# EAGLE design Radio_RPIv15_868 (EAGLE 8.4.3)
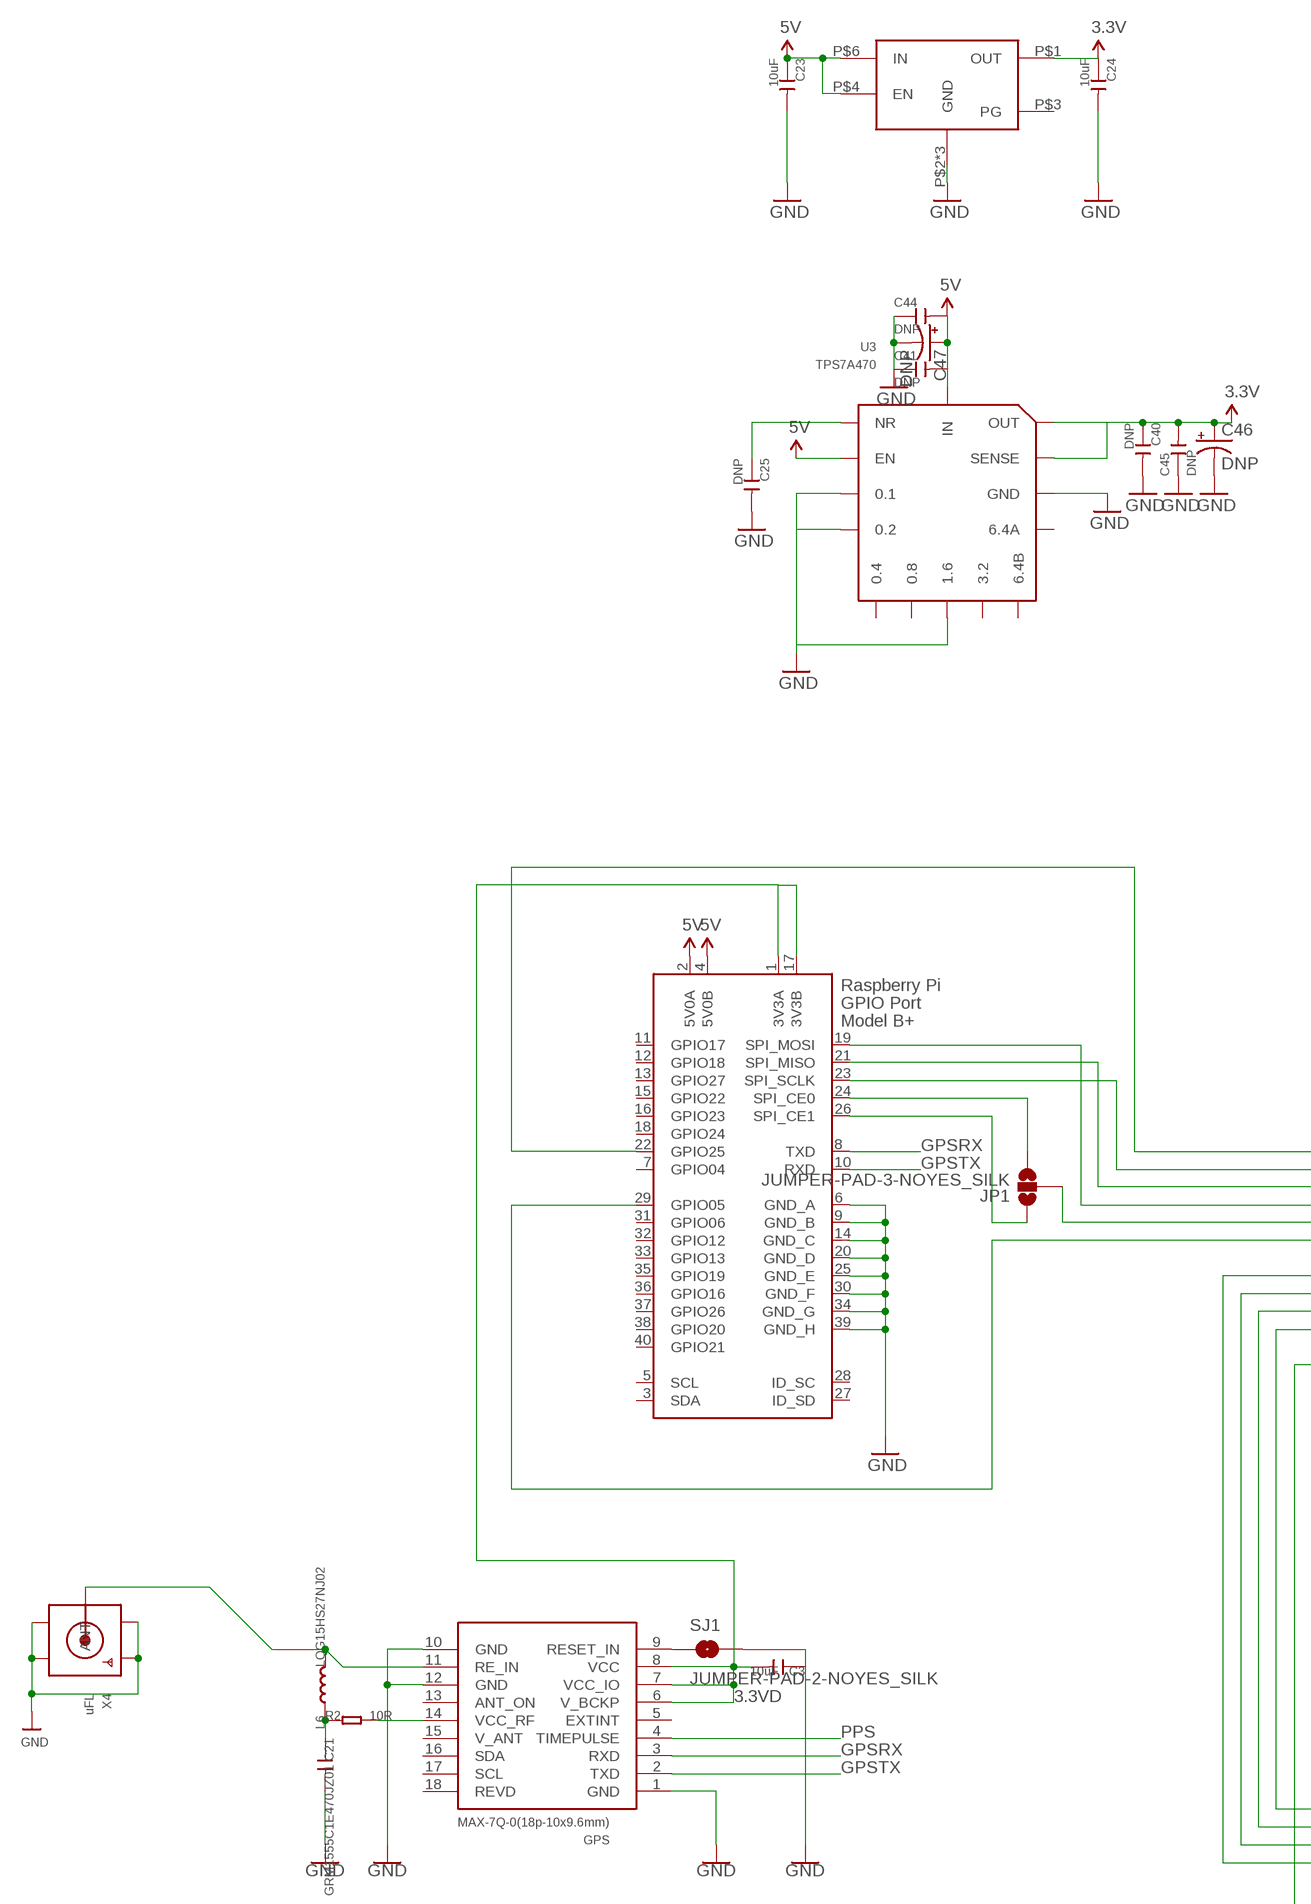
[diagram p0: schematic, sheet 1, part 1 of 3]
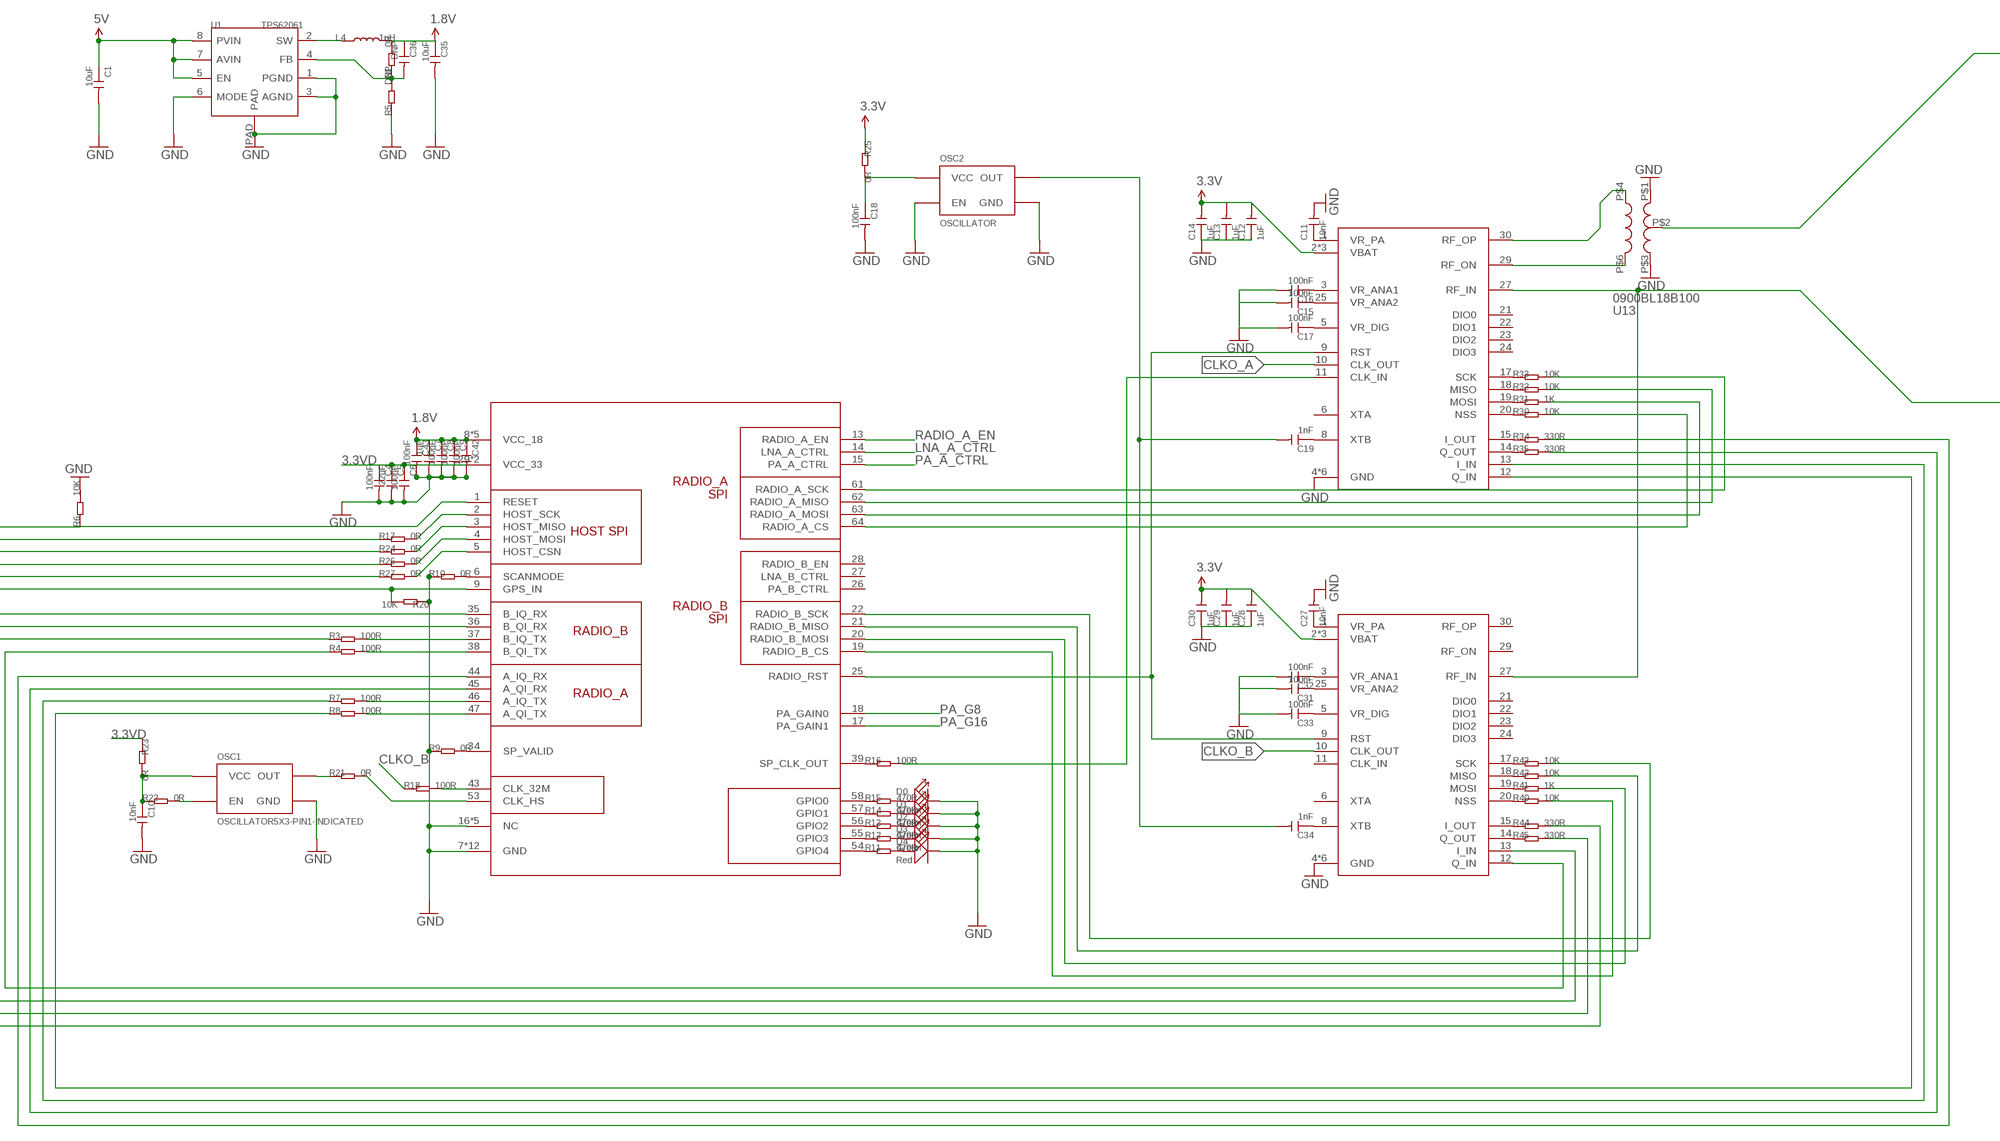
[diagram p1: schematic, sheet 1, part 2 of 3]
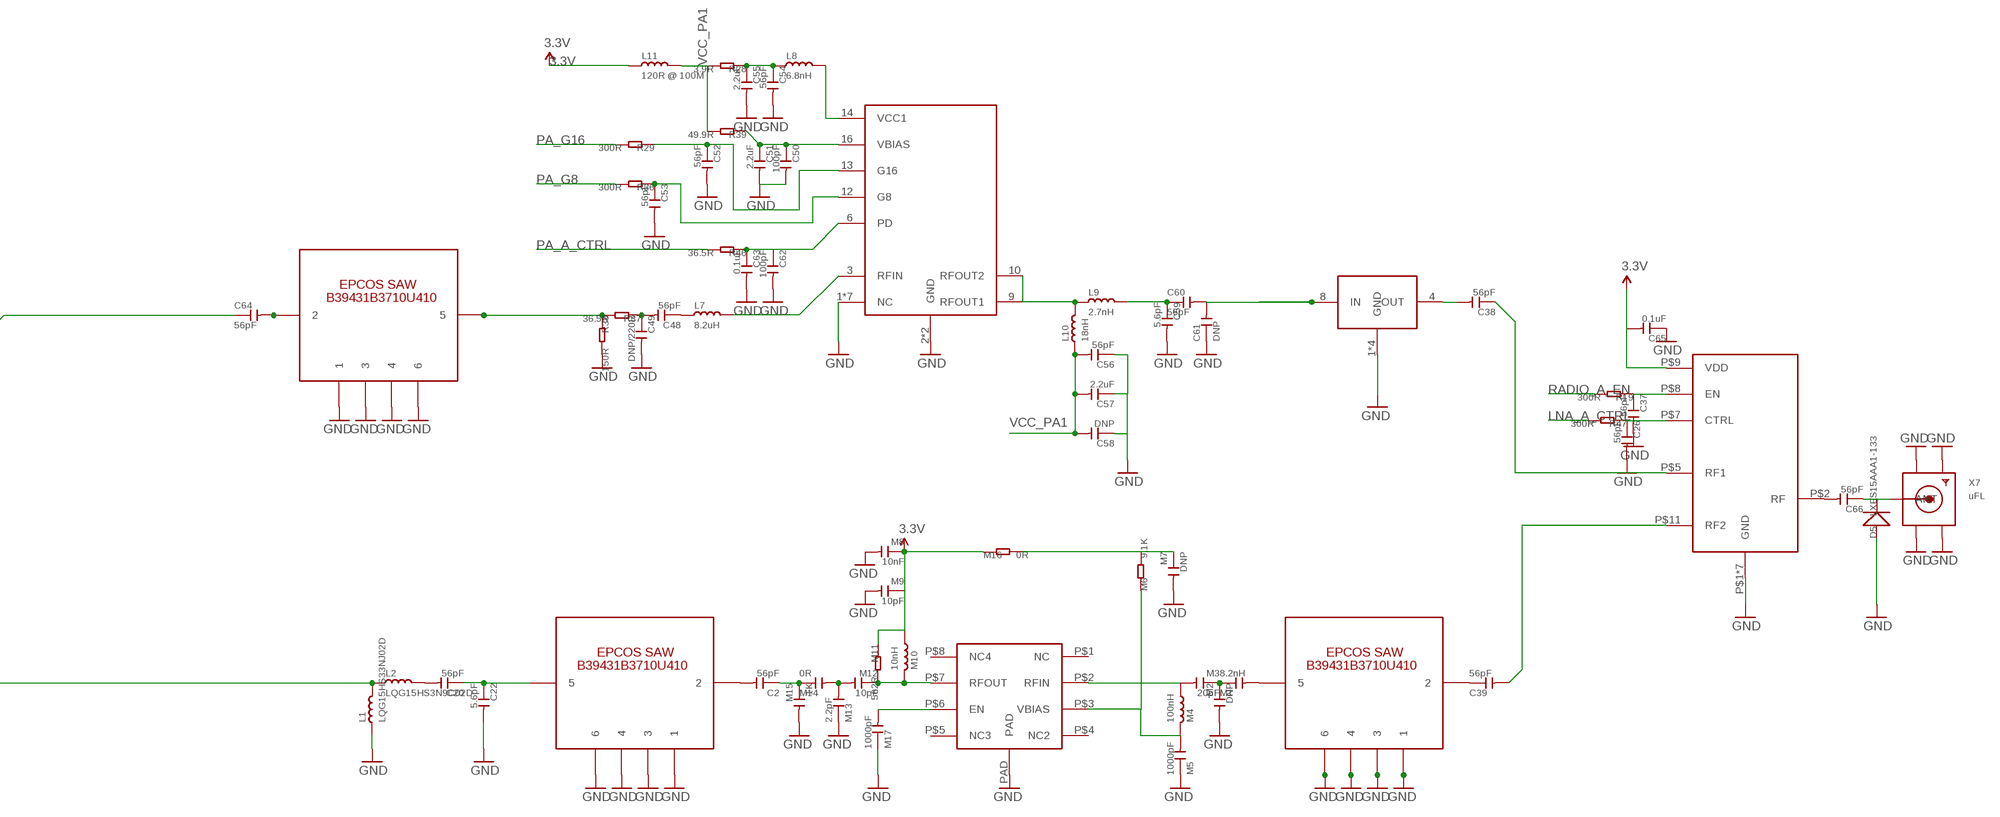
[diagram p2: schematic, sheet 1, part 3 of 3]

## Parts
C1  10uF  CAP-0603  [C0603@1]
C2  56pF  CAP-0402  [C0402@1]
C3  10uF  C-0603  [C0603]
C4  100nF  CAP-0402  [C0402@1]
C5  22uF  CAP-0402  [C0402@1]
C6  100nF  CAP-0402  [C0402@1]
C7  1uF  CAP-0402  [C0402@1]
C8  100nF  CAP-0402  [C0402@1]
C9  100nF  CAP-0402  [C0402@1]
C10  10nF  CAP-0402  [C0402@1]
C11  10nF  CAP-0402  [C0402@1]
C12  1uF  CAP-0402  [C0402@1]
C13  1uF  CAP-0402  [C0402@1]
C14  1uF  CAP-0402  [C0402@1]
C15  100nF  CAP-0402  [C0402@1]
C16  100nF  CAP-0402  [C0402@1]
C17  100nF  CAP-0402  [C0402@1]
C18  100nF  CAP-0402  [C0402@1]
C19  1nF  CAP-0402  [C0402@1]
C20  56pF  CAP-0402  [C0402@1]
C21  GRM1555C1E470JZ01  C-0402  [C0402]
C22  5.6pF  CAP-0402  [C0402@1]
C23  10uF  CAP-0603  [C0603@1]
C24  10uF  CAP-0603  [C0603@1]
C25  DNP  CAP-0402  [C0402@1]
C26  56pF  CAP-0402  [C0402@1]
C27  10nF  CAP-0402  [C0402@1]
C28  1uF  CAP-0402  [C0402@1]
C29  1uF  CAP-0402  [C0402@1]
C30  1uF  CAP-0402  [C0402@1]
C31  100nF  CAP-0402  [C0402@1]
C32  100nF  CAP-0402  [C0402@1]
C33  100nF  CAP-0402  [C0402@1]
C34  1nF  CAP-0402  [C0402@1]
C35  10uF  CAP-0603  [C0603@1]
C36  DNP  CAP-0402  [C0402@1]
C37  56pF  CAP-0402  [C0402@1]
C38  56pF  CAP-0402  [C0402@1]
C39  56pF  CAP-0402  [C0402@1]
C40  DNP  CAP-0402  [C0402@1]
C41  DNP  CAP-0402  [C0402@1]
C42  100nF  CAP-0402  [C0402@1]
C43  100nF  CAP-0402  [C0402@1]
C44  DNP  CAP-0805  [C0805@1]
C45  DNP  CAP-0805  [C0805@1]
C46  DNP  CAP_POL1206  [EIA3216]
C47  DNP  CAP_POL1206  [EIA3216]
C48  56pF  CAP-0402  [C0402@1]
C49  DNP/220R  CAP-0402  [C0402@1]
C50  100pF  CAP-0402  [C0402@1]
C51  2.2uF  CAP-0402  [C0402@1]
C52  56pF  CAP-0402  [C0402@1]
C53  56pF  CAP-0402  [C0402@1]
C54  56pF  CAP-0402  [C0402@1]
C55  2.2uF  CAP-0402  [C0402@1]
C56  56pF  CAP-0402  [C0402@1]
C57  2.2uF  CAP-0402  [C0402@1]
C58  DNP  CAP-0402  [C0402@1]
C59  5.6pF  CAP-0402  [C0402@1]
C60  56pF  CAP-0402  [C0402@1]
C61  DNP  CAP-0402  [C0402@1]
C62  100pF  CAP-0402  [C0402@1]
C63  0.1uF  CAP-0402  [C0402@1]
C64  56pF  CAP-0402  [C0402@1]
C65  0.1uF  CAP-0402  [C0402@1]
C66  56pF  CAP-0402  [C0402@1]
D0  Green  LED-0603  [LED-0603]
D1  Green  LED-0603  [LED-0603]
D2  Green  LED-0603  [LED-0603]
D3  Green  LED-0603  [LED-0603]
D4  Red  LED-0603  [LED-0603]
D5  LXES15AAA1-133  D  [C0402]
GPS  MAX-7Q-0(18p-10x9.6mm)  MODULE-GPS-SMD-MAX-7Q-0(18P-9.6X10MM)  [GPS18P-SMD-1.1-10X9.6MM]
JP1  JUMPER-PAD-3-NOYES_SILK  [PAD-JUMPER-3-NO_YES_SILK]
L1  LQG15HS33NJ02D  INDUCTOR/FERRITE-BEAD-0402  [L0402@1]
L2  LQG15HS3N9C02D  INDUCTOR/FERRITE-BEAD-0402  [L0402@1]
L4  1uH  L'1616BZ'  [1616BZ]
L6  LQG15HS27NJ02  L'0402'  [L0402]
L7  8.2uH  INDUCTOR/FERRITE-BEAD-0402  [L0402@1]
L8  6.8nH  INDUCTOR/FERRITE-BEAD-0402  [L0402@1]
L9  2.7nH  INDUCTOR/FERRITE-BEAD-0402  [L0402@1]
L10  18nH  INDUCTOR/FERRITE-BEAD-0402  [L0402@1]
L11  120R @ 100M  INDUCTOR/FERRITE-BEAD-0402  [L0402@1]
M1  8.2nH  CAP-0402  [C0402@1]
M2  DNP  CAP-0402  [C0402@1]
M3  20pF  CAP-0402  [C0402@1]
M4  100nH  INDUCTOR/FERRITE-BEAD-0402  [L0402@1]
M5  1000pF  CAP-0402  [C0402@1]
M6  9.1K  R-0402  [R0402]
M7  DNP  CAP-0402  [C0402@1]
M8  10nF  CAP-0402  [C0402@1]
M9  10pF  CAP-0402  [C0402@1]
M10  10nH  INDUCTOR/FERRITE-BEAD-0402  [L0402@1]
M11  562R  R-0402  [R0402]
M12  10pF  CAP-0402  [C0402@1]
M13  2.2pF  CAP-0402  [C0402@1]
M14  0R  CAP-0402  [C0402@1]
M15  1K  CAP-0402  [C0402@1]
M16  0R  R-0402  [R0402]
M17  1000pF  CAP-0402  [C0402@1]
OSC1  OSCILLATOR5X3-PIN1-INDICATED  [CRYSTAL-OSC-SMD-5X3]
OSC2  OSCILLATOR  [CRYSTAL-OSC-SMD-3.2X2.5]
R1  0R  R-0402  [R0402]
R2  10R  R-0402  [R0402]
R3  100R  R-0402  [R0402]
R4  100R  R-0402  [R0402]
R5  DNP  R-0402  [R0402]
R6  10K  R-0402  [R0402]
R7  100R  R-0402  [R0402]
R8  100R  R-0402  [R0402]
R9  0R  R-0402  [R0402]
R10  0R  R-0402  [R0402]
R11  470R  R-0402  [R0402]
R12  470R  R-0402  [R0402]
R13  470R  R-0402  [R0402]
R14  470R  R-0402  [R0402]
R15  470R  R-0402  [R0402]
R16  100R  R-0402  [R0402]
R17  0R  R-0402  [R0402]
R18  100R  R-0402  [R0402]
R19  300R  R-0402  [R0402]
R20  10K  R-0402  [R0402]
R21  0R  R-0402  [R0402]
R22  0R  R-0402  [R0402]
R23  0R  R-0402  [R0402]
R24  0R  R-0402  [R0402]
R25  0R  R-0402  [R0402]
R26  0R  R-0402  [R0402]
R27  0R  R-0402  [R0402]
R28  3.9R  R-0402  [R0402]
R29  300R  R-0402  [R0402]
R30  10K  R-0402  [R0402]
R31  1K  R-0402  [R0402]
R32  10K  R-0402  [R0402]
R33  10K  R-0402  [R0402]
R34  330R  R-0402  [R0402]
R35  330R  R-0402  [R0402]
R36  300R  R-0402  [R0402]
R37  36.5R  R-0402  [R0402]
R38  150R  R-0402  [R0402]
R39  49.9R  R-0402  [R0402]
R40  10K  R-0402  [R0402]
R41  1K  R-0402  [R0402]
R42  10K  R-0402  [R0402]
R43  10K  R-0402  [R0402]
R44  330R  R-0402  [R0402]
R45  330R  R-0402  [R0402]
R46  36.5R  R-0402  [R0402]
R47  300R  R-0402  [R0402]
SJ1  JUMPER-PAD-2-NOYES_SILK  [PAD-JUMPER-2-NO_YES_SILK]
U1  TPS62061  PMIC-ETA3410D2I-T(DFN8-2X2)WSON  [WSON]
U3  TPS7A470  [S-PVQFN-N20]
U6  RFPA0133  [QFN16-3X3MM]
U13  0900BL18B100  BALUN_1206  [BALUN_1206]
U$1  SX1301  [QFN64G-0.5-9X9MM]
U$2  SX1255  [QFN32G-0.5-5X5MM]
U$3  SX1255  [QFN32G-0.5-5X5MM]
U$4  B39921B3728U410  EPCOS_SAW_FILTER  [EPCOS_SAW_FILTER]
U$5  LP5912  [WSON6]
U$6  0915LP15B026  [0915LP15B026]
U$7  RFSW1012  [QFN12-2X2MM]
U$8  B39921B3728U410  EPCOS_SAW_FILTER  [EPCOS_SAW_FILTER]
U$9  EPCOS_SAW_FILTER  [EPCOS_SAW_FILTER]
U$10  SKY67150_396LF  [8DFN]
X1  RASPI_BOARD_B+#_H  [RASPI_BOARD_B+HAT]
X4  uFL  SMACONNECTOR_EDGE_UFL  [SMA_EDGELAUNCH_UFL]
X7  uFL  SMACONNECTOR_EDGE_UFL  [SMA_EDGELAUNCH_UFL]

## Nets
1.8V: C7.1 C8.1 C9.1 C35.1 C36.1 C42.1 C43.1 L4.2 R1.2 U$1.8(VCC_18) U$1.12(VCC_18) U$1.23(VCC_18) U$1.42(VCC_18) U$1.60(VCC_18)
3.3V: C12.2 C13.2 C14.2 C24.1 C28.2 C29.2 C30.2 C40.1 C45.2 C46.A(+) C65.2 L11.1 M8.1 M9.1 M10.2 M11.1 M16.1 R25.1 U3.1(OUT) U3.3(SENSE) U3.20(OUT) U$2.2(VBAT) U$2.16(VBAT) U$2.32(VBAT) U$3.2(VBAT) U$3.16(VBAT) U$3.32(VBAT) U$5.P$1(OUT) U$7.P$9(VDD)
3.3VD: C3.2 C4.1 C5.1 C6.1 GPS.6(V_BCKP) GPS.7(VCC_IO) GPS.8(VCC) R23.1 U$1.29(VCC_33) U$1.52(VCC_33) X1.1(3V3A) X1.17(3V3B)
5V: C1.1 C23.1 C41.2 C44.2 C47.A(+) U1.5(EN) U1.7(AVIN) U1.8(PVIN) U3.13(EN) U3.15(IN) U3.16(IN) U$5.P$4(EN) U$5.P$6(IN) X1.2(5V0A) X1.4(5V0B)
CLKO_A: U$2.10(CLK_OUT)
CLKO_B: R18.1 U$3.10(CLK_OUT)
CS: R27.2 U$1.5(HOST_CSN)
FEWF: D4.+ R11.2
GND: C1.2 C3.1 C4.2 C5.2 C6.2 C7.2 C8.2 C9.2 C10.2 C11.2 C12.1 C13.1 C14.1 C15.2 C16.2 C17.2 C18.2 C21.2 C22.2 C23.2 C24.2 C25.2 C26.2 C27.2 C28.1 C29.1 C30.1 C31.2 C32.2 C33.2 C35.2 C37.2 C40.2 C41.1 C42.2 C43.2 C44.1 C45.1 C46.C(-) C47.C(-) C49.2 C50.2 C51.2 C52.2 C53.2 C54.2 C55.2 C56.1 C57.1 C58.1 C59.2 C61.1 C62.2 C63.2 C65.1 D0.- D1.- D2.- D3.- D4.- D5.1(+) GPS.1(GND) GPS.10(GND) GPS.12(GND) L1.1 M2.2 M5.1 M7.2 M8.2 M9.2 M13.1 M15.2 M17.1 OSC1.2(GND) OSC2.P$1(EN) OSC2.P$2(GND) R5.1 R6.2 R9.1 R10.1 R20.1 R38.2 SJ1.2 U1.1(PGND) U1.3(AGND) U1.6(MODE) U1.PAD U3.2(GND) U3.7(GND) U3.8(1.6) U3.11(0.2) U3.12(0.1) U3.17(GND) U3.18(GND) U3.19(GND) U3.EXP(GND) U6.1(NC) U6.2(GND) U6.4(NC) U6.5(NC) U6.7(NC) U6.8(NC) U6.11(NC) U6.15(NC) U6.EXT(GND) U13.P$1(GND_1) U13.P$3(GND_2) U$1.7(GND) U$1.10(GND) U$1.11(GND) U$1.16(NC) U$1.24(GND) U$1.30(GND) U$1.31(GND) U$1.32(NC) U$1.33(NC) U$1.40(GND) U$1.41(GND) U$1.48(NC) U$1.49(NC) U$1.50(GND) U$1.51(GND) U$1.59(GND) U$1.65(GND) U$2.4(GND) U$2.7(GND) U$2.26(GND) U$2.28(GND) U$2.31(GND) U$2.33(GND) U$3.4(GND) U$3.7(GND) U$3.26(GND) U$3.28(GND) U$3.31(GND) U$3.33(GND) U$4.P$1 U$4.P$3 U$4.P$4 U$4.P$6 U$5.P$2(GND) U$5.P$5(GND) U$5.PAD(GND) U$6.1(GND) U$6.3(GND) U$6.5(GND) U$6.7(GND) U$7.P$1(GND) U$7.P$3(GND) U$7.P$4(GND) U$7.P$6(GND) U$7.P$10(GND) U$7.P$12(GND) U$7.PAD(GND) U$8.P$1 U$8.P$3 U$8.P$4 U$8.P$6 U$9.P$1 U$9.P$3 U$9.P$4 U$9.P$6 U$10.PAD X1.6(GND_A) X1.9(GND_B) X1.14(GND_C) X1.20(GND_D) X1.25(GND_E) X1.30(GND_F) X1.34(GND_G) X1.39(GND_H) X4.GND@1(GND1) X4.GND@2(GND2) X4.GND@3(GND3) X4.GND@4(GND4) X7.GND@1(GND1) X7.GND@2(GND2) X7.GND@3(GND3) X7.GND@4(GND4)
GPSRX: GPS.3(RXD) X1.8(TXD)
GPSTX: GPS.2(TXD) X1.10(RXD)
LNA_A_CTRL: R47.2 U$1.14(LNA_A_CTRL)
MISO: R24.1 X1.21(SPI_MISO)
MOSI: R26.1 X1.19(SPI_MOSI)
N$1: R30.1 U$2.20(NSS)
N$2: R45.2 U$1.36(B_QI_RX)
N$3: R3.2 U$1.37(B_IQ_TX)
N$4: R4.2 U$1.38(B_QI_TX)
N$5: R34.2 U$1.44(A_IQ_RX)
N$6: R7.2 U$1.46(A_IQ_TX)
N$7: R8.2 U$1.47(A_QI_TX)
N$8: R35.2 U$1.45(A_QI_RX)
N$9: R9.2 U$1.34(SP_VALID)
N$10: R10.2 U$1.6(SCANMODE)
N$11: C20.2 L2.2
N$12: R11.1 U$1.54(GPIO4)
N$13: R12.1 U$1.55(GPIO3)
N$14: R13.1 U$1.56(GPIO2)
N$15: R14.1 U$1.57(GPIO1)
N$16: R15.1 U$1.58(GPIO0)
N$17: C2.1 M14.1 M15.1
N$18: D3.+ R12.2
N$19: D1.+ R14.2
N$20: D0.+ R15.2
N$21: D2.+ R13.2
N$22: R16.1 U$1.39(SP_CLK_OUT)
N$23: C38.2 U$6.4(OUT)
N$24: C64.1 U13.P$2(UNBALANCE)
N$25: L4.1 U1.2(SW)
N$26: C36.2 R1.1 R5.2 U1.4(FB)
N$27: C21.1 L6.1 R2.1
N$28: JP1.3 X1.24(SPI_CE0)
N$29: C19.1 U$2.8(XTB)
N$30: R21.2 U$1.53(CLK_HS)
N$31: OSC1.3(OUT) R21.1
N$32: OSC1.1(EN) R22.2
N$33: C10.1 OSC1.4(VCC) R22.1 R23.2
N$34: GPS.14(VCC_RF) R2.2
N$35: C11.1 U$2.1(VR_PA)
N$36: C18.1 OSC2.P$4(VCC) R25.2
N$37: C19.2 C34.2 OSC2.P$3(OUT)
N$38: C15.1 U$2.25(VR_ANA2)
N$39: C16.1 U$2.3(VR_ANA1)
N$40: C17.1 U$2.5(VR_DIG)
N$41: GPS.11(RE_IN) L6.2 X4.P(ANT)
N$42: C39.1 U$9.P$2
N$43: R17.2 U$1.2(HOST_SCK)
N$44: C20.1 C22.1 U$4.P$5
N$45: R18.2 U$1.43(CLK_32M)
N$46: C2.2 U$4.P$2
N$47: GPS.9(RESET_IN) SJ1.1
N$48: R24.2 U$1.3(HOST_MISO)
N$49: L1.2 L2.1 U$2.27(RF_IN) U$3.27(RF_IN)
N$50: R26.2 U$1.4(HOST_MOSI)
N$51: JP1.2 R27.1
N$52: C25.1 U3.14(NR)
N$53: U13.P$4(BALANCE_1) U$2.30(RF_OP)
N$54: U13.P$6(BALANCE_2) U$2.29(RF_ON)
N$55: L7.2 U6.3(RFIN)
N$56: R34.1 U$2.15(I_OUT)
N$57: R35.1 U$2.14(Q_OUT)
N$58: C27.1 U$3.1(VR_PA)
N$59: C31.1 U$3.25(VR_ANA2)
N$60: C32.1 U$3.3(VR_ANA1)
N$61: C33.1 U$3.5(VR_DIG)
N$62: C34.1 U$3.8(XTB)
N$63: C48.1 L7.1
N$64: C64.2 U$8.P$2
N$65: C52.1 R29.1 U6.13(G16)
N$66: C53.1 R36.1 U6.12(G8)
N$67: L8.2 U6.14(VCC1)
N$68: C54.1 C55.1 L8.1 R28.1
N$69: L9.1 L10.2 U6.9(RFOUT1) U6.10(RFOUT2)
N$70: C59.1 C60.1 L9.2
N$71: C60.2 C61.2 U$6.8(IN)
N$72: C48.2 C49.1 R37.1
N$73: C62.1 C63.1 R46.1 U6.6(PD)
N$74: C38.1 U$7.P$5(RF1)
N$75: C66.2 U$7.P$2(RF)
N$76: R37.2 R38.1 U$8.P$5
N$77: C26.1 R47.1 U$7.P$7(CTRL)
N$78: R44.1 U$3.15(I_OUT)
N$79: R45.1 U$3.14(Q_OUT)
N$80: R33.2 U$1.61(RADIO_A_SCK)
N$81: R32.2 U$1.62(RADIO_A_MISO)
N$82: R31.2 U$1.63(RADIO_A_MOSI)
N$83: R30.2 U$1.64(RADIO_A_CS)
N$84: R43.2 U$1.22(RADIO_B_SCK)
N$85: R42.2 U$1.21(RADIO_B_MISO)
N$86: R41.2 U$1.20(RADIO_B_MOSI)
N$87: R40.2 U$1.19(RADIO_B_CS)
N$88: U$1.25(RADIO_RST) U$2.9(RST) U$3.9(RST)
N$89: R16.2 U$2.11(CLK_IN)
N$90: R44.2 U$1.35(B_IQ_RX)
N$91: R7.1 U$2.13(I_IN)
N$92: R3.1 U$3.13(I_IN)
N$93: R4.1 U$3.12(Q_IN)
N$94: R8.1 U$2.12(Q_IN)
N$95: JP1.1 X1.26(SPI_CE1)
N$96: C66.1 D5.2(-) X7.P(ANT)
N$97: C39.2 U$7.P$11(RF2)
N$98: M1.2 U$9.P$5
N$99: M1.1 M2.1 M3.1
N$100: R31.1 U$2.19(MOSI)
N$101: R32.1 U$2.18(MISO)
N$102: R33.1 U$2.17(SCK)
N$103: R40.1 U$3.20(NSS)
N$104: R41.1 U$3.19(MOSI)
N$105: R42.1 U$3.18(MISO)
N$106: R43.1 U$3.17(SCK)
N$107: M6.2 M7.1 M16.2
N$108: M10.1 M11.2 M12.1 U$10.P$7(RFOUT)
N$109: M12.2 M13.2 M14.2
N$110: C37.1 R19.1 U$7.P$8(EN)
N$111: M17.2 U$10.P$6(EN)
N$112: M3.2 M4.2 U$10.P$2(RFIN)
N$113: M4.1 M5.2 M6.1 U$10.P$3(VBIAS)
PA_A_CTRL: R46.2 U$1.15(PA_A_CTRL)
PA_G8: R36.2 U$1.18(PA_GAIN0)
PA_G16: R29.2 U$1.17(PA_GAIN1)
PPS: GPS.4(TIMEPULSE) R20.2 U$1.9(GPS_IN) X1.29(GPIO05)
RADIO_A_EN: R19.2 U$1.13(RADIO_A_EN)
RST: R6.1 U$1.1(RESET) X1.22(GPIO25)
SCK: R17.1 X1.23(SPI_SCLK)
VBIAS: C50.1 C51.1 R39.1 U6.16(VBIAS)
VCC_PA1: C56.2 C57.2 C58.2 L10.1 L11.2 R28.2 R39.2
Unconnected: GPS.5(EXTINT) GPS.13(ANT_ON) GPS.15(V_ANT) GPS.16(SDA) GPS.17(SCL) GPS.18(REVD) U3.4(6.4A) U3.5(6.4B) U3.6(3.2) U3.9(0.8) U3.10(0.4) U$1.26(PA_B_CTRL) U$1.27(LNA_B_CTRL) U$1.28(RADIO_B_EN) U$2.6(XTA) U$2.21(DIO0) U$2.22(DIO1) U$2.23(DIO2) U$2.24(DIO3) U$3.6(XTA) U$3.11(CLK_IN) U$3.21(DIO0) U$3.22(DIO1) U$3.23(DIO2) U$3.24(DIO3) U$3.29(RF_ON) U$3.30(RF_OP) U$5.P$3(PG) U$10.P$1(NC) U$10.P$4(NC2) U$10.P$5(NC3) U$10.P$8(NC4) X1.3(SDA) X1.5(SCL) X1.7(GPIO04) X1.11(GPIO17) X1.12(GPIO18) X1.13(GPIO27) X1.15(GPIO22) X1.16(GPIO23) X1.18(GPIO24) X1.27(ID_SD) X1.28(ID_SC) X1.31(GPIO06) X1.32(GPIO12) X1.33(GPIO13) X1.35(GPIO19) X1.36(GPIO16) X1.37(GPIO26) X1.38(GPIO20) X1.40(GPIO21)

## Library data of the parts
C1 C2 C4-C20 C22-C45 C48-C66 M1-M3 M5 M7-M9 M12-M15 M17 = Discrete:CAP: Ceramic Capacitors
C3 C21 = Discrete:C*: Ceramic Capacitors
C46 C47 = SparkFun-Capacitors:CAP_POL: Capacitor Polarized These are standard SMD and PTH capacitors. Normally 10uF, 47uF, and 100uF in electrolytic and tantalum varieties. Always verify the external diameter of the through hole cap, it varies with capacity, voltage, and manufacturer. The EIA devices should be standard.
D0 D1-D4 = Discrete:LED
D5 = Discrete:D*
GPS = Seeed-OPL-Moudle:MODULE-GPS-SMD-MAX-7Q-0(18P-9.6X10MM): 317050009; MPN: MAX-7Q-0
JP1 = SparkFun-Passives:JUMPER-PAD-3-NO
L1 L2 L7-L11 M4 M10 = Discrete:INDUCTOR/FERRITE-BEAD
L4 L6 = Discrete:L*
M6 M11 M16 R1-R47 = Discrete:R*
OSC1 OSC2 = SparkFun-FreqCtrl:OSCILLATOR: Generic 5x3 and 7x5 oscillators
SJ1 = SparkFun-Passives:JUMPER-PAD-2-NO
U1 = Seeed-OPL-ic:PMIC-ETA3410D2I-T(DFN8-2X2): 310030161
U3 = regulator-jqi:TPS7A470: Ultra-low noise LDO regulator, variable programmable output, 36V
U6 = SparkFun-IC-Power:RFPA0133
U13 = SparkFun-RF:BALUN_1206
U$1 = Seeed-OPL-ic:SX1301
U$2 U$3 = Seeed-OPL-ic:SX1255
U$4 U$8 U$9 = Ava:EPCOS_SAW_FILTER
U$5 = IC:LP5912
U$6 = SparkFun-RF:0915LP15B026
U$7 = SparkFun-IC-Power:RFSW1012
U$10 = SparkFun-RF:SKY67150_396LF
X1 = raspberrypi_bastelstube_v13:RASPI_BOARD_B+#: Raspberry Pi GPIO connector with markings for the outer dimensions of the Raspberry Pi board model B+ with different sets of drill holes or mounting pads All pins connected
X4 X7 = microbuilder:SMACONNECTOR: SMA Connector 90° DIP SMA Connector, 50 Ohm (4UConnector: 07259)

## Net classes
2 VIN: width 0.61 mm, drill 0.61 mm, clearance 0.305 mm

## Board
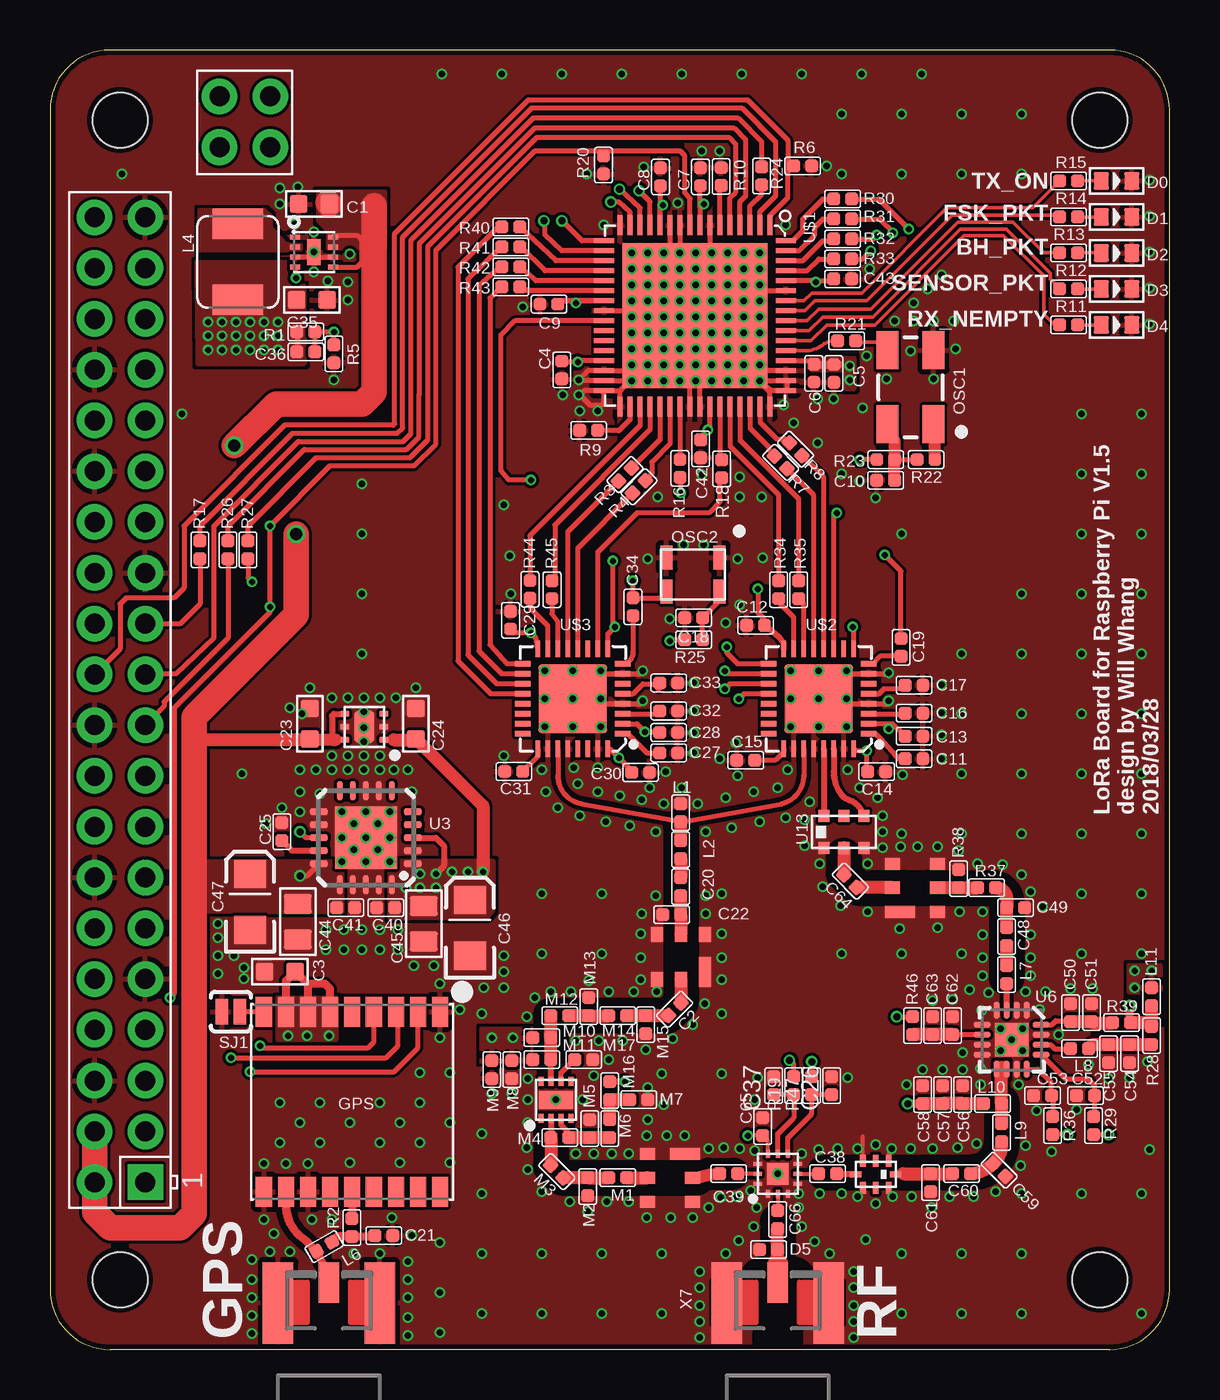
[diagram p3: board, top side]
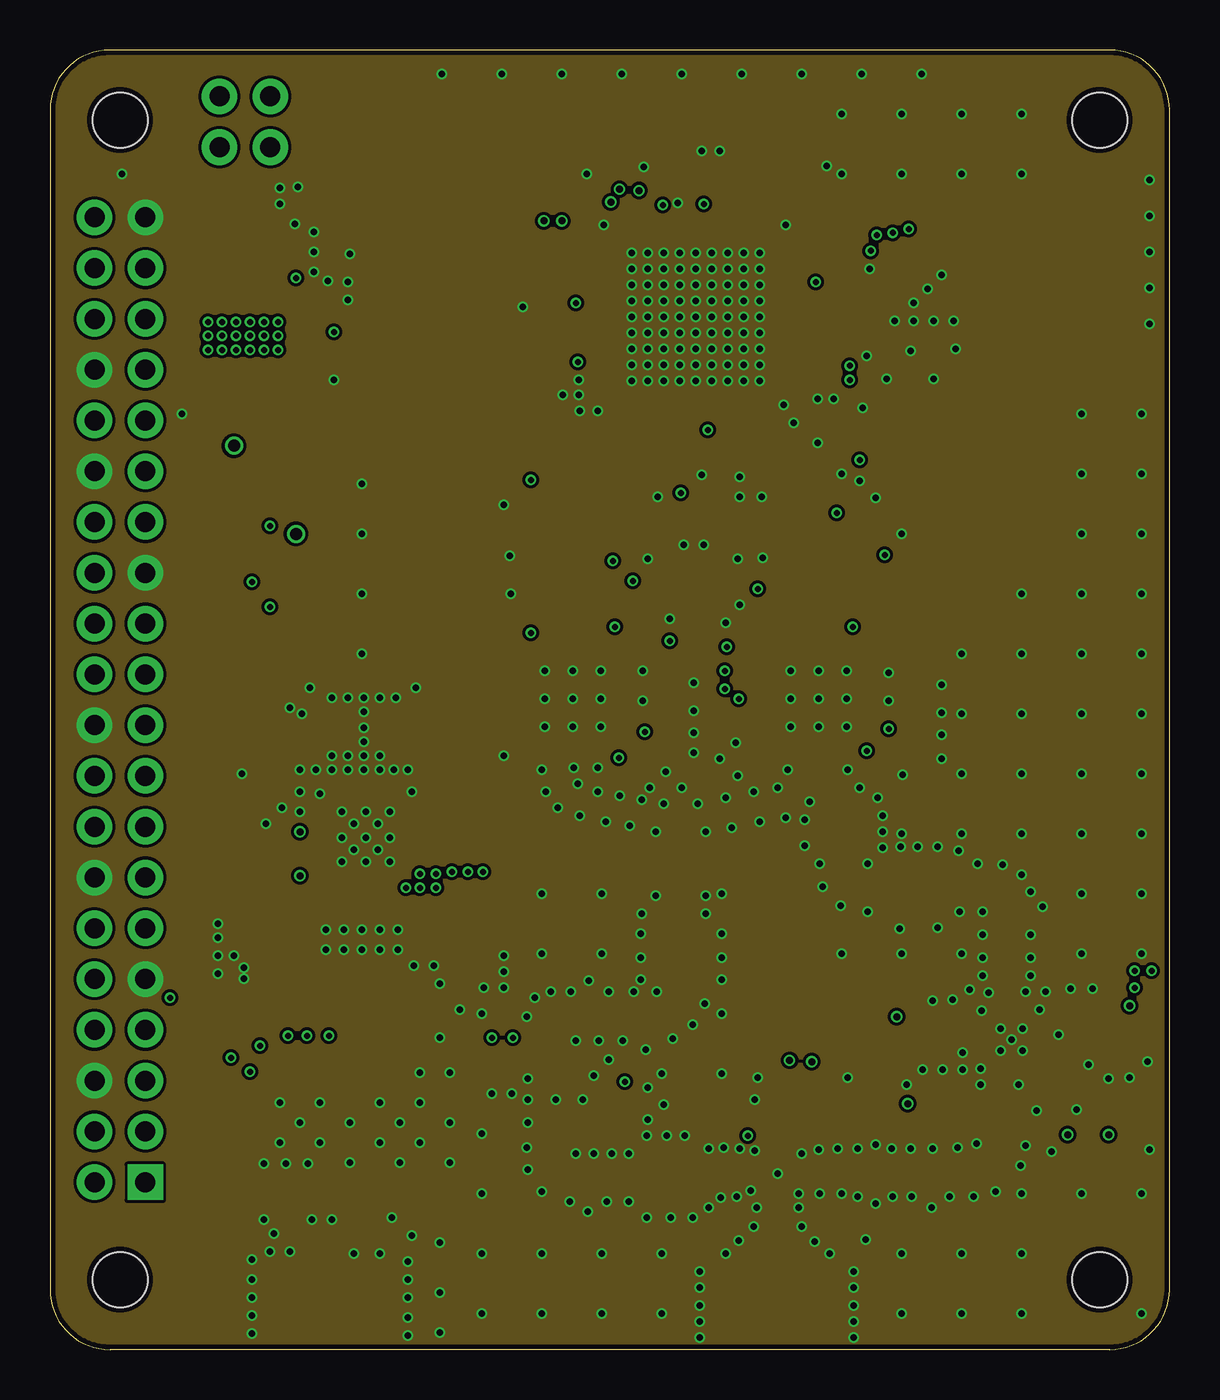
[diagram p4: board, inner layer $GND]
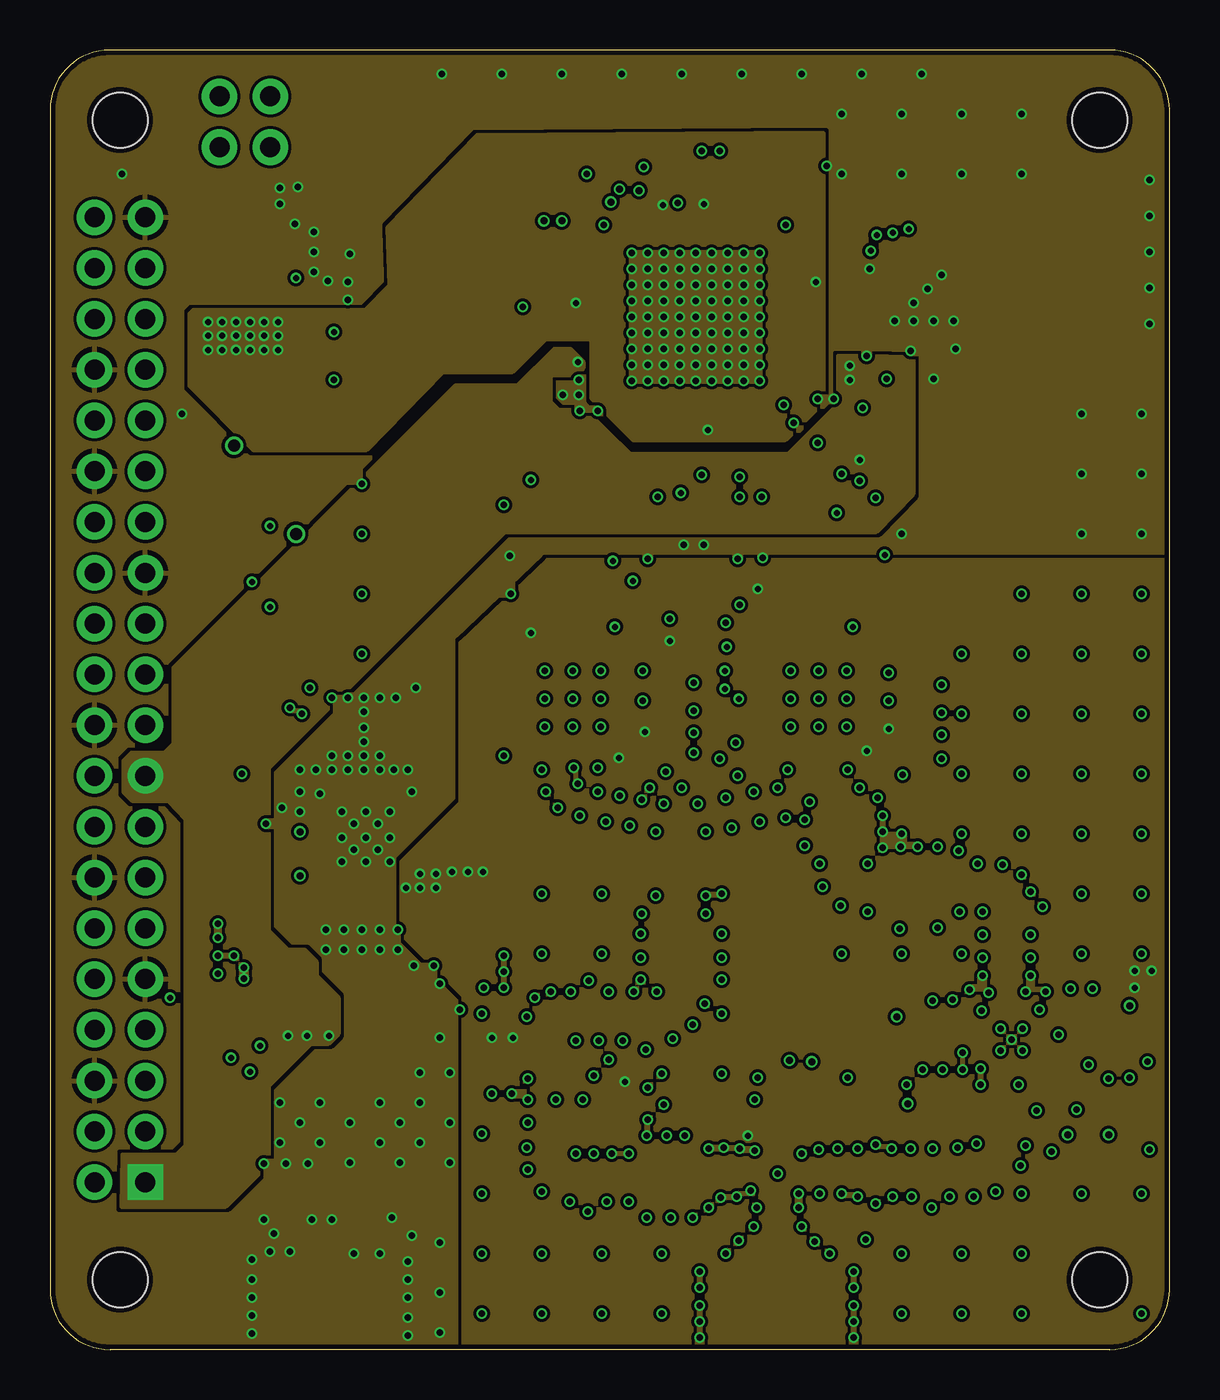
[diagram p5: board, inner layer $VCC]
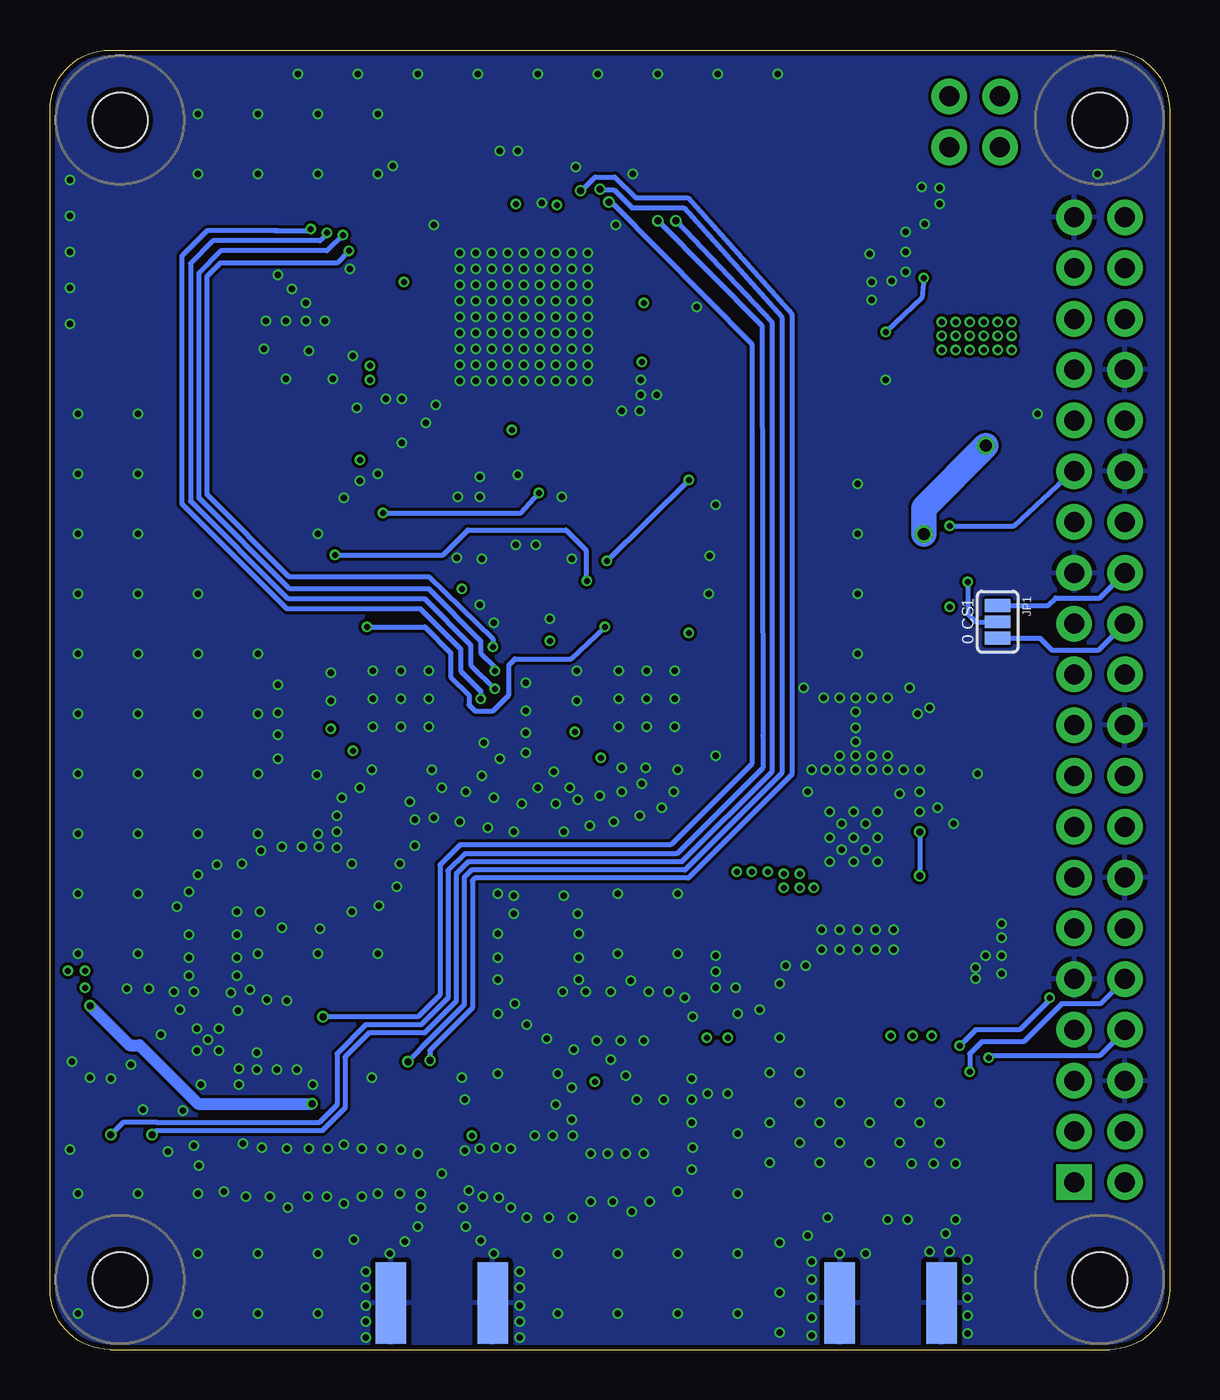
[diagram p6: board, bottom side, seen from below]

Size 56 x 65 mm. Coordinates in mm from the lower left corner, seen from the top.
Copper layers (1*2*15*16): Top 0.035mm / dielectric 0.2mm / $GND 0.0175mm / dielectric 0.3mm / $VCC 0.0175mm / dielectric 0.2mm / Bottom 0.035mm
Design rules "SeeedStudio_4layer_DRU_no_angle_20140221 *": minimum track width 6mil, minimum drill 0.3mm, track to track 6mil, track to pad 8mil, pad to pad 8mil, via to via 8mil, smd to smd 0mil, copper to edge 10mil, drill to drill 8mil, minimum pad ring 6mil, minimum via ring 4mil, stop-mask expansion 4mil, vias tented up to drill 25mil, thermal gap 10mil
tRestrict: 50 lines

### Footprints (pad centres in the part's own frame; a part is rotated, then mirrored left to right if it is on the bottom)
C0603@1 = smd 0.889 x 0.889: 1 -0.762,0; 2 0.762,0
C0402@1 = smd 0.635 x 0.635: 1 -0.445,0; 2 0.445,0
C0603 = smd 0.889 x 0.889: 1 -0.762,0; 2 0.762,0
C0402 = smd 0.635 x 0.635: 1 -0.445,0; 2 0.445,0
C0805@1 = smd 1.016 x 1.397: 1 -0.889,0; 2 0.889,0
EIA3216 = smd 1.4 x 1.6: A 1.4,0; C -1.4,0
LED-0603 = smd 0.762 x 0.889: + -0.762,0; - 0.762,0
GPS18P-SMD-1.1-10X9.6MM = smd 1.5 x 0.8: 1 -4.5,4.4; 2 -4.5,3.3; 3 -4.5,2.2; 4 -4.5,1.1; 5 -4.5,0; 6 -4.5,-1.1; 7 -4.5,-2.2; 8 -4.5,-3.3; 9 -4.5,-4.4; 10 4.5,-4.4; 11 4.5,-3.3; 12 4.5,-2.2; 13 4.5,-1.1; 14 4.5,0; 15 4.5,1.1; 16 4.5,2.2; 17 4.5,3.3; 18 4.5,4.4
PAD-JUMPER-3-NO_YES_SILK = smd 0.635 x 1.27: 1 -0.813,0; 2 0,0; 3 0.813,0
L0402@1 = smd 0.635 x 0.635: 1 -0.445,0; 2 0.445,0
1616BZ = smd 1.524 x 2.54: 1 -1.905,0; 2 1.905,0
L0402 = smd 0.635 x 0.635: 1 -0.445,0; 2 0.445,0
R0402 = smd 0.635 x 0.635: 1 -0.445,0; 2 0.445,0
CRYSTAL-OSC-SMD-5X3 = smd 1.9 x 1.1: 1 -1.85,-1.15; 2 1.85,-1.15; 3 1.85,1.15; 4 -1.85,1.15
CRYSTAL-OSC-SMD-3.2X2.5 = smd 0.6 x 1.2: P$1 -1.325,-0.85; P$2 1.325,-0.85; P$3 1.325,0.85; P$4 -1.325,0.85
PAD-JUMPER-2-NO_YES_SILK = smd 0.635 x 1.27: 1 -0.45,0; 2 0.45,0
WSON = smd 0.25 x 0.5: 1 -0.75,-0.95; 2 -0.25,-0.95; 3 0.25,-0.95; 4 0.75,-0.95; 5 0.75,0.95; 6 0.25,0.95; 7 -0.25,0.95; 8 -0.75,0.95 | smd 1.3 x 0.7: PAD 0,0
S-PVQFN-N20 = smd 0.9 x 0.3: 1 -2.35,1.3; 2 -2.35,0.65; 3 -2.35,0; 4 -2.35,-0.65; 5 -2.35,-1.3; 11 2.35,-1.3; 12 2.35,-0.65; 13 2.35,0; 14 2.35,0.65; 15 2.35,1.3 | smd 0.3 x 0.9: 6 -1.3,-2.35; 7 -0.65,-2.35; 8 0,-2.35; 9 0.65,-2.35; 10 1.3,-2.35; 16 1.3,2.35; 17 0.65,2.35; 18 0,2.35; 19 -0.65,2.35; 20 -1.3,2.35 | smd 3.1 x 3.1: EXP 0,0
QFN16-3X3MM = smd 0.85 x 0.28: 1 -1.475,0.75; 2 -1.475,0.25; 3 -1.475,-0.25; 4 -1.475,-0.75; 9 1.475,-0.75; 10 1.475,-0.25; 11 1.475,0.25; 12 1.475,0.75 | smd 0.28 x 0.85: 5 -0.75,-1.475; 6 -0.25,-1.475; 7 0.25,-1.475; 8 0.75,-1.475; 13 0.75,1.475; 14 0.25,1.475; 15 -0.25,1.475; 16 -0.75,1.475 | smd 1.68 x 1.68: EXT 0,0
BALUN_1206 = smd 0.55 x 0.6: P$1 -0.6,1.6; P$2 -1.6,1.6; P$3 -2.6,1.6; P$4 -2.6,0; P$5 -1.6,0; P$6 -0.6,0
QFN64G-0.5-9X9MM = smd 1 x 0.25: 1 -4.55,3.75; 2 -4.55,3.25; 3 -4.55,2.75; 4 -4.55,2.25; 5 -4.55,1.75; 6 -4.55,1.25; 7 -4.55,0.75; 8 -4.55,0.25; 9 -4.55,-0.25; 10 -4.55,-0.75; 11 -4.55,-1.25; 12 -4.55,-1.75; 13 -4.55,-2.25; 14 -4.55,-2.75; 15 -4.55,-3.25; 16 -4.55,-3.75; 33 4.55,-3.75; 34 4.55,-3.25; 35 4.55,-2.75; 36 4.55,-2.25; 37 4.55,-1.75; 38 4.55,-1.25; 39 4.55,-0.75; 40 4.55,-0.25; 41 4.55,0.25; 42 4.55,0.75; 43 4.55,1.25; 44 4.55,1.75; 45 4.55,2.25; 46 4.55,2.75; 47 4.55,3.25; 48 4.55,3.75 | smd 0.25 x 1: 17 -3.75,-4.55; 18 -3.25,-4.55; 19 -2.75,-4.55; 20 -2.25,-4.55; 21 -1.75,-4.55; 22 -1.25,-4.55; 23 -0.75,-4.55; 24 -0.25,-4.55; 25 0.25,-4.55; 26 0.75,-4.55; 27 1.25,-4.55; 28 1.75,-4.55; 29 2.25,-4.55; 30 2.75,-4.55; 31 3.25,-4.55; 32 3.75,-4.55; 49 3.75,4.55; 50 3.25,4.55; 51 2.75,4.55; 52 2.25,4.55; 53 1.75,4.55; 54 1.25,4.55; 55 0.75,4.55; 56 0.25,4.55; 57 -0.25,4.55; 58 -0.75,4.55; 59 -1.25,4.55; 60 -1.75,4.55; 61 -2.25,4.55; 62 -2.75,4.55; 63 -3.25,4.55; 64 -3.75,4.55 | smd 7.25 x 7.25: 65 0,0
QFN32G-0.5-5X5MM = smd 0.813 x 0.279: 1 -2.5,1.75; 2 -2.5,1.25; 3 -2.5,0.75; 4 -2.5,0.25; 5 -2.5,-0.25; 6 -2.5,-0.75; 7 -2.5,-1.25; 8 -2.5,-1.75; 17 2.5,-1.75; 18 2.5,-1.25; 19 2.5,-0.75; 20 2.5,-0.25; 21 2.5,0.25; 22 2.5,0.75; 23 2.5,1.25; 24 2.5,1.75 | smd 0.279 x 0.813: 9 -1.75,-2.5; 10 -1.25,-2.5; 11 -0.75,-2.5; 12 -0.25,-2.5; 13 0.25,-2.5; 14 0.75,-2.5; 15 1.25,-2.5; 16 1.75,-2.5; 25 1.75,2.5; 26 1.25,2.5; 27 0.75,2.5; 28 0.25,2.5; 29 -0.25,2.5; 30 -0.75,2.5; 31 -1.25,2.5; 32 -1.75,2.5 | smd 3.429 x 3.429: 33 0,0
EPCOS_SAW_FILTER = smd 0.6 x 1.5: P$1 -1.2,0.75 | smd 0.6 x 0.75: P$2 0,1.125; P$3 1.2,1.125; P$4 1.2,-1.125; P$5 0,-1.125; P$6 -1.2,-1.125
WSON6 = smd 0.45 x 0.3: P$1 0,0; P$2 0,-0.65; P$3 0,-1.3; P$4 1.95,-1.3; P$5 1.95,-0.65; P$6 1.95,0 | smd 1 x 1.6: PAD 0.975,-0.65
0915LP15B026 = smd 0.3 x 0.6: 1 1.65,1.3; 2 1,1.3; 3 0.35,1.3; 5 0.35,-0.05; 6 1,-0.05; 7 1.65,-0.05 | smd 0.6 x 0.3: 4 0,0.625; 8 2,0.625
QFN12-2X2MM = smd 0.4 x 0.2: P$1 0,1.5; P$2 0,1; P$3 0,0.5; P$7 2,0.5; P$8 2,1; P$9 2,1.5 | smd 0.2 x 0.4: P$4 0.5,0; P$5 1,0; P$6 1.5,0; P$10 1.5,2; P$11 1,2; P$12 0.5,2 | smd 1.1 x 1.1: PAD 1,1
8DFN = smd 0.45 x 0.25: P$1 -0.925,0.75; P$2 -0.925,0.25; P$3 -0.925,-0.25; P$4 -0.925,-0.75; P$5 0.925,-0.75; P$6 0.925,-0.25; P$7 0.925,0.25; P$8 0.925,0.75 | smd 0.9 x 1.7: PAD 0,0
RASPI_BOARD_B+HAT = drill 1 pad 1.778 square: 1 8.37,51.23 | drill 1 pad 1.778: 2 8.37,53.77; 3 10.91,51.23; 4 10.91,53.77; 5 13.45,51.23; 6 13.45,53.77; 7 15.99,51.23; 8 15.99,53.77; 9 18.53,51.23; 10 18.53,53.77; 11 21.07,51.23; 12 21.07,53.77; 13 23.61,51.23; 14 23.61,53.77; 15 26.15,51.23; 16 26.15,53.77; 17 28.69,51.23; 18 28.69,53.77; 19 31.23,51.23; 20 31.23,53.77; 21 33.77,51.23; 22 33.77,53.77; 23 36.31,51.23; 24 36.31,53.77; 25 38.85,51.23; 26 38.85,53.77; 27 41.39,51.23; 28 41.39,53.77; 29 43.93,51.23; 30 43.93,53.77; 31 46.47,51.23; 32 46.47,53.77; 33 49.01,51.23; 34 49.01,53.77; 35 51.55,51.23; 36 51.55,53.77; 37 54.09,51.23; 38 54.09,53.77; 39 56.63,51.23; 40 56.63,53.77; POE_1 60.136,47.52; POE_2 62.676,47.52; POE_3 60.136,44.98; POE_4 62.676,44.98 | hole 2.75: 3.5,3.5; 3.5,52.5; 61.5,3.5; 61.5,52.5
SMA_EDGELAUNCH_UFL = smd 4.064 x 1.524: GND@1 2.032,-2.54; GND@2 2.032,2.54 | smd 4.064 x 1.524 bottom: GND@3 2.032,2.54; GND@4 2.032,-2.54 | smd 2.032 x 1.016: P 3.048,0

### Placement (x,y rotation side)
C1  13.2,57.3 180 top
C2  31.24,17.02 45 top
C3  11.5,18.9 0 top
C4  25.6,48.99 270 top
C5  39.21,48.82 270 top
C6  38.21,48.83 270 top
C7  32.54,58.66 90 top
C8  30.54,58.65 90 top
C9  24.96,52.29 180 top
C10  41.8,43.48 180 top
C11  43.22,29.55 0 top
C12  35.29,36.22 0 top
C13  43.22,30.68 180 top
C14  41.35,28.9 180 top
C15  34.8,29.47 180 top
C16  43.22,31.83 0 top
C17  43.22,33.23 0 top
C18  32.2,36.6 180 top
C19  42.57,35.12 90 top
C20  31.55,23.15 90 top
C21  16.7,5.7 0 top
C22  31.1,21.75 180 top
C23  13,31.3 90 top
C24  18.3,31.3 90 top
C25  11.6,25.9 90 top
C26  39.1,13.2 90 top
C27  30.95,29.84 0 top
C28  30.95,30.86 180 top
C29  23.04,36.48 270 top
C30  29.54,28.86 180 top
C31  23.2,28.91 180 top
C32  30.95,31.94 0 top
C33  30.95,33.34 0 top
C34  29.16,37.15 90 top
C35  13.1,52.5 0 top
C36  12.8,49.9 0 top
C37  36.2,13.2 90 top
C38  38.9,8.8 0 top
C39  33.95,8.8 0 top
C40  16.8,22.1 180 top
C41  14.8,22.1 180 top
C42  32.55,45.05 270 top
C43  39.65,53.55 0 top
C44  12.4,21.4 90 top
C45  18.7,21.3 90 top
C46  21,21.1 90 top
C47  10,22.4 90 top
C48  47.85,20.65 90 top
C49  48.3,22.1 0 top
C50  51.05,16.85 90 top
C51  52.1,16.85 90 top
C52  51.8,12.7 180 top
C53  49.65,12.7 180 top
C54  54,14.8 270 top
C55  52.95,14.8 270 top
C56  45.65,12.75 270 top
C57  44.65,12.75 270 top
C58  43.65,12.75 270 top
C59  47.48,8.97 315 top
C60  45.6,8.8 180 top
C61  44.05,8.35 90 top
C62  45.15,16.2 90 top
C63  44.15,16.2 90 top
C64  40.04,23.43 315 top
C65  35.65,11.15 270 top
C66  36.4,6.5 90 top
D0  53.35,58.45 0 top
D1  53.35,56.65 0 top
D2  53.35,54.84 0 top
D3  53.35,53.05 0 top
D4  53.35,51.25 0 top
D5  35.95,5 0 top
GPS  15.1,12.4 270 top
JP1  8.6,36.4 270 bottom
L1  31.55,26.85 270 top
L2  31.55,25 270 top
L4  9.4,54.4 270 top
L6  13.71,5.15 210 top
L7  47.85,18.75 270 top
L8  51.5,15.05 180 top
L9  47.6,10.85 270 top
L10  47.15,12.3 0 top
L11  55.1,17.65 270 top
M1  28.4,8.6 0 top
M2  26.9,8.15 270 top
M3  25.36,8.9 135 top
M4  25.5,10.6 180 top
M5  27,11.05 270 top
M6  28,11.05 90 top
M7  29.45,12.5 0 top
M8  23.1,14 270 top
M9  22.1,14 270 top
M10  24.6,15.6 180 top
M11  24.6,14.5 0 top
M12  25.5,16.7 0 top
M13  26.95,17.15 270 top
M14  28.4,16.7 180 top
M15  29.8,16.25 270 top
M16  28,12.95 270 top
M17  26.7,14.5 180 top
OSC1  43.04,48.13 90 top
OSC2  32.17,38.77 180 top
R1  12.8,50.9 180 top
R2  15.1,6.1 90 top
R3  28.76,43.76 45 top
R4  29.46,43.15 45 top
R5  14.2,49.8 90 top
R6  37.65,59.2 0 top
R7  36.56,44.37 135 top
R8  37.29,45.04 135 top
R9  26.94,45.97 0 top
R10  33.57,58.67 270 top
R11  50.95,51.25 0 top
R12  50.95,53.05 0 top
R13  50.95,54.85 0 top
R14  50.95,56.65 0 top
R15  50.95,58.45 0 top
R16  31.51,44.07 270 top
R17  7.5,40 90 top
R18  33.6,44.05 90 top
R19  37.2,13.2 90 top
R20  27.69,59.24 90 top
R21  39.85,50.45 180 top
R22  43.82,44.51 0 top
R23  41.81,44.51 0 top
R24  35.6,58.7 270 top
R25  32.2,35.5 0 top
R26  8.9,40 90 top
R27  9.9,40 90 top
R28  55.1,15.7 90 top
R29  52.2,11.2 270 top
R30  39.65,57.55 180 top
R31  39.65,56.55 180 top
R32  39.65,55.55 180 top
R33  39.65,54.55 180 top
R34  36.45,38.01 90 top
R35  37.45,38 90 top
R36  50.15,11.2 270 top
R37  46.85,23.1 180 top
R38  45.45,23.55 90 top
R39  53.6,16.35 0 top
R40  23.05,56.15 0 top
R41  23.05,55.15 0 top
R42  23.05,54.15 0 top
R43  23.05,53.15 0 top
R44  24.01,38.02 90 top
R45  25.11,38.01 90 top
R46  43.15,16.2 90 top
R47  38.1,13.2 90 top
SJ1  9.05,16.9 180 top
U1  13.2,54.9 270 top
U3  15.8,25.6 180 top
U6  48.1,15.5 270 top
U13  38.1,26.7 180 top
U$1  32.27,51.7 270 top
U$2  38.45,32.55 180 top
U$3  26.15,32.55 180 top
U$4  31.55,19.65 180 top
U$5  16.7,30.5 180 top
U$6  40.3,8.15 0 top
U$7  37.4,7.8 90 top
U$8  43.25,23.1 90 top
U$9  31,8.6 270 top
U$10  25.3,12.5 90 top
X1  56,0 90 top
X4  13.95,0.3 90 top
X7  36.4,0.3 90 top

### Tracks (layer width: path | path; a pad name or v marks a point on that pad's centre or on a via)
1.8V  (via drill 0.3)
  Top 0.254: R1.2 C36.1 | C8.1 30.52,58.28 U$1.12 30.52,57.23 v30.65,57.25 | 32.52,57.1 U$1.8 | 32.52,57.1 32.52,58.2 C7.1 | v32.7,57.3 32.6,57.28 32.52,57.1 | 38.3,53.45 U$1.60 | 38.3,53.45 39.1,53.45 C43.1 | v38.3,53.4 38.25,53.4 38.3,53.45 | U$1.42 33.02,46.12 v32.9,46 32.5,45.6 32.5,45.44 C42.1
  Top 0.28: U$1.23 26.2,52.45 | 26.2,52.45 25.27,52.45 arc90 C9.1 | v26.3,52.35 arc90 26.2,52.45
  other vias: 9.3,50 8.6,51.4 10,51.4 10,50.7 10,50 9.3,51.4 9.3,50.7 10.7,50.7 10.7,51.4 7.9,50 8.6,50 7.9,50.7 8.6,50.7 11.4,51.4 11.4,50.7 11.4,50 10.7,50 7.9,51.4
  pour Top (no thermals): 12.65,54.4 12.7,49.3 7.4,49.3 7.35,54.4
  pour $VCC (no thermals): 27.1,50.55 24.75,50.55 23.1,48.9 19.6,48.9 15.8,45 10.2,45 7,48.2 7,51.8 7.2,52 15.8,52 17,53.2 16.9,56.1 21.4,60.75 38.65,60.85 38.65,47.4 36.75,45.5 29.2,45.5 27.1,47.6
3.3V  (via drill 0.3)
  Top 0.2: U$7.P$9 35.9,10.46 C65.2 34.85,10.71 v34.9,10.7
  Top 0.254: 42.16,31.3 U$2.2 | 42.16,31.3 C13.2 | U$3.16 24.3,35.6 v24.05,35.85 23.23,35.85 C29.2 | R25.1 31,35.5 v31.01,35.46 v31,35.45 | U$3.2 29.35,31.3 v29.75,30.9 29.69,30.86 C28.2 | U$3.32 28,30.05 v28.45,29.6 29.1,28.95 C30.2 | v41.95,31.05 41.95,31.09 42.16,31.3 | v35.4,38.05 35.4,36.85 35.7,36.55 35.7,36.3 C12.2 | U$2.32 40.3,29.95 v40.85,29.95 40.85,28.96 C14.2
  Top 0.305: C12.2 35.78,36.22 | U$2.16 36.7,35.3 36.45,35.65 35.78,36.22 | 35.78,36.22 35.75,36.25 | v28.75,13.4 28.79,13.39 M16.1 | U3.3 19.3,25.6 19.7,25.2 19.7,24.2 v19.3,23.8 | U$5.P$1 17.2,30.5
  Top 0.64: 17.2,30.5 18.26,30.5 C24.1 21.65,27.19 v21.65,23.9
  other vias: 20.9,23.9 19.3,23.1 23.15,15.6 22.1,15.6 55.1,18.95 54.25,18.1 54.25,18.95 18.5,23.1 20.1,23.9 18.5,23.8 17.8,23.1
  pour $VCC (no thermals): 20.55,35.35 24.9,39.5 56,39.5 56.05,0 20.7,0 20.7,17.7 17.6,20.8 17.6,24.4 20.55,27.35
  pour Top (no thermals): 17,21.6 17,24.45 22.15,24.45 22.15,22 21.8,21.6
  pour Top: 21.6,16.05 24.4,16.05 24.4,14.25 21.6,14.25
  pour Top: 54,19.2 55.5,19.2 55.5,17.9 54,17.9
3.3VD  (via drill 0.3)
  Top 0.254: U$1.52 38.18,49.45 C6.1 | R23.1 v40.51,44.51 v40.5,44.5 | U$1.29 26.45,49.45 v26.4,49.4 25.63,49.4 C4.1
  Top 0.406: GPS.8 11.8,18.44 C3.2 12.9,18.26 | GPS.7 12.9,18.26 | GPS.6 14,18.05 13.75,18.3 12.94,18.3 12.9,18.26 | C6.1 39.47,49.27 C5.1
  other vias: 40,49.2 40,48.5 11.9,15.7 12.85,15.7 13.95,15.7
  pour $VCC (no thermals): 3.65,9.75 6.35,9.75 6.8,10.2 6.8,26.55 5.95,27.45 4.15,27.45 3.7,27.9 3.7,29.45 4.1,29.85 5.75,29.85 6.2,30.3 6.2,34.1 20.3,48.2 23.4,48.2 25.25,50.05 26,50.05 26.65,49.4 26.65,49.1 26.3,48.75 25,48.7 25,47.4 25.4,47 26.65,47 26.7,47.05 29,44.8 36.95,44.8 39.45,47.3 39.45,49.7 43.15,49.65 43.15,42.8 41.3,40.9 22.7,40.9 10.9,29.1 10.9,20.95 11.85,20 12.7,20 13.3,19.4 13.3,18.7 14.4,17.6 14.4,15.8 13.9,15.3 13,15.3 10.9,13.2 10.9,9.3 8.75,7.15 3.6,7.15
  pour Top (no thermals): 11.4,17.6 14.3,17.6 14.3,15.5 11.4,15.5
  pour Top (no thermals): 38.1,49.6 40.2,49.6 40.2,48.05 39.85,48.05 39.85,49 38.1,49
5V  (via drill 0.35, 0.6)
  Top 0.254: U1.5 15.35,54.15 15.6,54.4 15.6,55.5 15.4,55.7 14.2,55.7 U1.8 | 7.55,13.2 7.2,12.85 | 7.5,23.39 7.25,23.39 7.35,23.45 7.2,23.6 | 7.2,20.25 7.25,20.25 7.25,20.2 | U3.13 12.8,25.6 v12.5,25.9 | v12.5,23.7 12.85,23.7 U3.15
  Top 0.305: 7.4,13.2 7.2,13.4 | U$5.P$6 14.3,30.5 | U$5.P$4 14.2,31.8 14.1,31.7 14.1,30.5
  Top 0.61: C23.1 13.04,30.5 14.1,30.5 14.3,30.5
  Top 0.64: 13.04,30.5 7.6,30.5 7.2,30.1
  Top 1.27: X1.4 X1.2 2.23,6.87 3,6.1 6.5,6.1 7.2,6.8 7.2,12.85 7.2,13.4 7.2,20.25 7.2,23.6 7.2,30.1 7.2,31.65 12.3,36.75 v12.3,40.8 | 13.9,57.36 C1.1 | v9.2,45.2 11.3,47.3 15.6,47.3 16.2,47.9 16.2,57.2
  Bottom 0.254: v12.5,25.9 v12.5,23.7
  Bottom 1.27: v12.3,40.8 12.3,42.1 v9.2,45.2
  pour Top (no thermals): 13.4,57.9 13.4,56.5 13.9,56 13.9,55.1 16.75,55.1 16.75,57.9
  pour Top (no thermals): 6.8,21.95 14.6,21.9 14.6,24.4 6.85,24.4
CLKO_B
  Top 0.254: U$3.10 27.4,39.9 29.35,41.85 32.95,41.85 33.52,42.42 33.52,43.53 R18.1
CS
  Top 0.254: U$1.5 34.02,57.62 34.3,57.9 34.3,60.3 34,60.6 24.32,60.6 18.89,55.17 18.89,45.5 18,44.61 13.31,44.61 9.9,41.2 R27.2
FEWF
  Top 0.178: R11.2 D4.+
GND  (via drill 0.33)
  Top 0.178: 31.35,54.95 31,54.95 30.93,55.02
  Top 0.2: U$6.3 40.65,10.65 | U$6.1 41.95,10.05 v42.1,10.05
  Top 0.254: 29,55.1 29.1,55.1 29.1,55 29.05,54.95 | U$1.11 31.02,55.12 30.93,55.02 30.85,54.95 29.05,54.95 | U$1.10 31.52,55.12 31.35,54.95 32.95,54.95 33.05,55.05 33.02,55.08 U$1.7 | U$1.24 29.35,51.95 | 29.35,51.95 29.35,49.15 | 29.35,49.15 29.15,48.95 U$1.30 26.9,48.95 26.7,48.75 | U$1.40 32.02,48.52 | 32.02,48.52 32.05,48.55 | 29.35,49.15 29.6,49.15 | 29.6,49.15 31.39,49.15 | 31.39,49.15 32.02,48.52 | 32.52,48.32 32.75,48.45 34.95,48.45 35.05,48.55 35.25,48.35 35.55,48.35 35.75,48.15 | U$1.48 36.02,47.88 35.75,48.15 | U$1.51 35.35,48.95 35.35,48.85 35.75,48.45 36.85,48.45 36.85,48.05 36.75,47.95 36.05,47.95 35.85,48.15 35.75,48.15 | U$1.41 32.52,48.32 | 32.52,48.32 32.52,48.42 32.65,48.55 32.65,51.05 32.15,51.55 32.15,51.65 32.25,51.75 | 29.05,54.95 29.05,52.25 29.35,51.95 | 31.39,49.15 31.39,50.82 U$1.65 34.2,51.7 35.45,52.95 U$1.59 36.85,52.95 | 26.6,48.45 U$1.31 28.85,48.45 29.6,49.15 | U$1.32 26.7,47.95 26.5,47.75 27,47.25 27.6,47.25 27.7,47.35 27.7,47.85 27.8,47.95 28.5,47.95 | 28.5,47.15 28.5,47.95 | 28.5,47.95 29,48.45 | 13.2,54.65 U1.3 | U1.PAD 13.2,54.65 | 13.2,54.65 U1.6
  Top 0.28: 27.7,33.8 29.5,33.8 | 27.7,32.3 29.5,32.3 | 40.1,33.8 41.9,33.8 | 40.1,32.3 41.9,32.3
  other vias: 44.6,29.55 14.2,48.5 44.6,30.75 44.6,31.85 44.6,33.25 38.45,32.55 26.15,32.55 23.05,37.8 31.7,40.25 32.7,40.25 34.4,39.55 32.6,43.75 37.2,46.35 38.4,45.35 36.7,47.25 40.5,43.45 43.2,51.45 43.2,52.35 32.6,59.95 33.5,59.95 29.7,59.15 13.9,53.45 14.9,53.4 14.9,52.5 12.4,58.15 11.5,57.3 11.5,58.1 34.3,30.35 33.5,29.55 26.45,48.5 29.65,32.45 29.65,33.95 27.4,46.95 26.45,47.75 29.1,54.85 29.1,54.05 29.9,54.85 29.9,54.05 29.1,53.25 29.9,53.25 30.7,54.85 30.7,54.05 31.5,54.85 31.5,54.05 30.7,53.25 31.5,53.25 32.3,54.85 32.3,54.05 33.1,54.85 33.1,54.05 32.3,53.25 33.1,53.25 33.9,54.85 33.9,54.05 34.7,54.85 34.7,54.05 33.9,53.25 34.7,53.25 35.5,54.85 35.5,54.05 35.5,53.25 29.1,50.05 29.1,49.25 29.9,50.05 29.9,49.25 29.1,48.45 29.9,48.45 30.7,50.05 30.7,49.25 31.5,50.05 31.5,49.25 30.7,48.45 31.5,48.45 32.3,50.05 32.3,49.25 33.1,50.05 33.1,49.25 32.3,48.45 33.1,48.45 33.9,50.05 33.9,49.25 34.7,50.05 34.7,49.25 33.9,48.45 34.7,48.45 35.5,50.05 35.5,49.25 35.5,48.45 29.1,52.45 29.1,51.65 29.9,52.45 29.9,51.65 29.1,50.85 29.9,50.85 30.7,52.45 30.7,51.65 31.5,52.45 31.5,51.65 30.7,50.85 31.5,50.85 32.3,52.45 32.3,51.65 33.1,52.45 33.1,51.65 32.3,50.85 33.1,50.85 33.9,52.45 33.9,51.65 34.7,52.45 34.7,51.65 33.9,50.85 34.7,50.85 35.5,52.45 35.5,51.65 35.5,50.85 41,54.05 23.65,52.15 31,36.55 33.8,36.35 38.85,59.2 36.8,56.25 26.5,46.95 9.7,18.55 19.5,15.6 20.5,17 19.5,18.3 9.7,19.1 10.7,6.5 11.2,5.8 12,4.9 13.1,6.5 14.1,6.5 18.1,5.7 17.1,6.6 10.7,9.3 12.9,9.3 11.8,9.3 10.1,4.5 10.1,3.5 10.1,2.6 10.1,1.7 10.1,0.8 17.9,4.4 17.9,3.5 17.9,2.6 17.9,1.6 17.9,0.7 16.5,4.8 15.2,4.8 11,4.9 13.2,54.9 15,54.8 25.65,47.75 40.85,49.7 27.7,56.25 31.4,57.35 29.9,39.55 32.2,29.85 32.2,30.85 32.2,31.95 32.2,33.35 34.5,37.25 19.5,0.85 19.5,2.85 19.5,5.35 18.5,12.35 16.5,12.35 13.5,12.35 11.5,12.35 11.5,10.35 13.5,10.35 16.5,10.35 18.5,10.35 15,11.35 12.5,11.35 17.5,11.35 15,9.35 18.5,13.85 20,13.85 20,11.35 20,9.35 17.5,9.35 22.7,42.25 23,39.7 35.65,39.6 55,10 50.1,9.9 35.25,12.5 45.15,17.5 55,58.5 50.45,15.75 43.05,49.95 42.25,51.45 43.9,53.05 45.2,51.45 45.3,50.05 44.2,51.45 41.85,48.55 40.65,47.1 38.4,47.55 24.75,33.95 24.75,31.15 26.15,31.15 27.55,31.15 27.55,32.55 24.75,32.55 27.55,33.95 26.15,33.95 39.85,32.55 39.85,31.15 38.45,31.15 37.05,31.15 37.05,32.55 37.05,33.95 38.45,33.95 39.85,33.95 41.95,33.85 41.95,32.45 19.2,19.2 37.75,25.2 38.5,24.3 40.9,24.3 41.65,25.1 42.55,25.15 43.4,25.15 44.4,25.15 47.65,24.25 45.45,24.95 44.4,21.1 42.5,21.05 49.65,22.15 44.15,17.45 45.65,14 44.65,14 43.65,14 42.85,13.25 45.65,14.85 49.35,11.95 51.35,12 51.95,14.25 52.95,13.55 54,13.6 54.9,14.4 51.05,18.05 52.15,18.05 48.8,17.9 49.5,17 26.85,58.8 22.7,29.7 26.95,18.45 27.45,15.45 27.2,13.7 26.65,12.5 25.3,12.5 23.9,12.5 22.1,12.8 23.1,12.8 23.9,13.55 29.9,11.5 30.7,12.25 29.9,13.1 48.45,13.25 48.1,15.5 47.55,16.05 48.65,14.95 48.65,16.05 47.55,14.95 46.95,17.85 46.6,16.95 36.4,8.8 35.25,9.95 34.5,10.05 33.7,10.1 24.6,29 24.6,22.8 27.6,22.8 27.6,19.8 24.6,19.8 22.7,18.1 21.6,16.8 21.6,10.8 30.85,10.7 34.35,7.65 33.6,13.8 33.6,16.8 33.6,19.6 33.6,22.8 21.6,7.8 21.6,4.8 21.6,1.8 24.6,1.8 27.6,1.8 30.6,1.8 30.6,4.8 27.6,4.8 24.6,4.8 33.8,4.8 30.6,13.8 39.9,13.6 40.4,10.05 39.6,19.8 42.6,19.8 45.6,19.8 51.6,22.8 51.6,19.8 54.6,19.8 54.6,22.8 51.6,25.8 54.6,25.8 48.6,25.8 45.6,25.8 42.6,25.8 45.6,28.8 48.6,28.8 51.6,28.8 54.6,28.8 40.8,5.5 42.6,4.8 45.6,4.8 48.6,4.8 48.6,1.8 45.6,1.8 42.6,1.8 54.6,1.8 54.6,7.8 51.6,7.8 48.6,7.8 46.2,7.65 39.6,7.8 48.6,31.8 51.6,31.8 54.6,31.8 54.6,34.8 51.6,34.8 48.6,34.8 45.6,34.8 45.6,31.8 48.6,37.8 51.6,37.8 54.6,37.8 51.6,40.8 54.6,40.8 54.6,43.8 51.6,43.8 42.6,40.8 41.3,42.6 39.6,43.8 51.6,46.8 54.6,46.8 23.85,10.1 23.9,9 26.3,9.8 27.2,9.8 28.1,9.8 28.95,9.8 24.6,7.9 26,7.4 27.85,7.4 28.95,7.4 32.95,7.1 33.55,7.6 35.05,7.95 29.85,10.7 31.75,10.7 32.95,10.05 29.85,6.6 31.05,6.6 32.15,6.6 24.25,17.6 23.85,16.65 25.05,17.9 26.05,17.9 27.95,17.9 29.2,17.9 30.35,17.9 29.55,20.8 29.55,18.5 32.75,17.3 32.15,16.25 29.8,15 28.65,15.45 26.3,15.45 31.15,15.55 29.55,19.6 33.6,20.8 33.6,18.5 32.8,22.7 32.8,25.9 30.3,25.9 30.3,22.7 29.6,21.8 32.8,21.8 37.75,26.5 38,27.4 36.8,26.6 35.5,26.4 34.1,26.1 32.4,27.3 31.6,28.1 30.7,27.3 33.8,27.6 35.2,27.9 36.4,28.1 36.9,29 34.4,28.7 30.8,28.9 30,28.1 29,26.2 27.8,26.4 26.5,26.7 25.4,27.1 24.8,27.9 26.2,29.1 26.4,28.3 27.4,27.9 28.5,27.7 29.6,27.5 39.9,29 40.5,28.1 41.4,27.6 41.65,26.7 41.65,25.9 38.65,23.15 39.55,22.2 40.9,21.9 45.5,21.9 46.65,21.9 46.65,20.75 46.65,19.6 46.65,18.7 46,18 49.05,20.75 49.05,19.6 49.05,18.7 49.8,17.9 48.6,23.75 49.05,22.9 46.55,13.25 46.55,14.05 46.35,10.3 45.4,10.1 44.15,10.05 39.4,10.05 38.45,10 37.6,9.8 37.45,7.8 38.5,7.8 40.4,7.65 43.1,7.65 44.1,7.1 42.15,7.65 41.3,10.25 47.3,7.9 48.8,10.2 48.55,9.2 45,7.65 35.35,7.1 37.45,7.1 37.6,6.15 38.25,5.4 39,4.8 35.2,6.15 34.45,5.45 32.5,3.9 32.5,3.1 32.5,2.2 32.5,1.4 32.5,0.6 40.2,3.9 40.2,3.1 40.2,2.2 40.2,1.4 40.2,0.6 27.4,29.1 26.9,6.9 43.05,10.05 41.3,7.3 9.6,28.8 15.7,31.1 12.6,31.8 12,32.1 15.6,34.8 15.6,37.8 15.6,40.8 15.6,43.3 3.6,58.8 39.6,61.8 42.6,61.8 45.6,61.8 45.6,58.8 48.6,58.8 48.6,61.8 42.6,58.8 39.6,58.8 19.6,63.8 22.6,63.8 25.6,63.8 28.6,63.8 31.6,63.8 34.6,63.8 37.6,63.8 43.6,63.8 40.6,63.8 6.6,46.8 55,56.7 55,54.9 55,53.1 55,51.3 30.4,42.65 34.5,42.65 34.5,43.65 35.6,42.65 39.2,47.55 44.6,53.75 44.2,48.55 27.95,14.5 23.9,11.35 46.4,24.3 12.25,56.3 13.2,55.9 13.2,53.9 42.65,28.75 15.7,30.4 15.7,31.9 15.7,32.6 16.5,32.6 14.9,32.6 13,33.1 14.1,32.6 17.3,32.6 18.3,33.1 15.7,29.7 14.7,21 13.8,21 13.8,20 14.7,20 16.5,21 16.5,20 17.4,20 17.4,21 15.6,21 15.6,20 18.2,19.2 22.7,19.7 22.7,18.9 21.7,18.1 8.4,21.3 8.4,20.6 8.4,19.7 8.4,18.8 9.2,19.7 11.6,27.1 10.8,26.3 15.8,25.6 14.6,26.9 14.6,25.6 14.6,24.4 17,24.4 17,25.6 17,26.9 15.8,26.9 15.8,24.4 14.9,29.7 16.5,29.7 15.2,25 15.2,26.3 16.4,26.3 16.4,25 12.5,26.9 12.5,27.9 12.5,29 13.3,29 35.4,13.6 15.7,29 16.5,29 17.2,29 14.9,29 14.1,29.7 14.1,29 17.9,29 18.1,27.9 13.5,27.8
  pour Bottom: 56,65 -2.35,64.9 -2.05,-0.1 56,0
  pour Top (rank 2): 56,65 -1.65,65 -1.35,0 56,0
  pour $GND (no thermals): -3.05,64.9 -2.75,-0.15 54.4,0 56.05,0.05 56.05,65.1
  pour Top (rank 2, no thermals): 22.45,28.15 60.8,28.4 60.7,-5.1 22.7,-5.1
  pour Top (rank 3, no thermals): 6.9,32.8 20.3,32.8 21.4,31.7 21.4,21.7 22.9,20.2 22.9,18 6.8,18
  pour $VCC (rank 2): 0,0 56,0 56,65.1 0,65.1
GPSRX  (via drill 0.3)
  Top 0.254: v9.05,14.6 16.8,14.6 17.4,15.2 17.4,16.8 GPS.3
  Bottom 0.254: X1.8 2.23,15.97 3.5,14.7 8.95,14.7 v9.05,14.6
GPSTX  (via drill 0.3)
  Top 0.254: v10,13.9 17.2,13.9 18.4,15.1 GPS.2
  Bottom 0.254: X1.10 3.46,17.3 5.4,17.3 7.3,15.4 9.4,15.4 10,14.8 v10,13.9
LNA_A_CTRL  (via drill 0.35)
  Top 0.254: U$1.14 29.52,57.1 v28.48,58.03 | v38.1,14.4 R47.2
  Bottom 0.254: v28.48,58.03 28.46,58.01 27.8,58.01 26.89,57.1 24.3,57.1 19.4,51.65 19.4,28.82 24.24,23.99 34.91,23.99 35.28,23.62 35.28,17.25 37.4,15.13 v38.1,14.4
MISO
  Top 0.254: R24.1 35.6,60.4 34.4,61.6 24.18,61.6 18.05,55.48 18.05,45.81 17.66,45.42 12.42,45.42 8.2,41.2 8.2,35.6 6.3,33.8 4.8,33.8 X1.21
MOSI
  Top 0.254: R26.1 8.9,35.6 5.7,32.4 5.7,32.16 X1.19
N$1  (via drill 0.3)
  Top 0.254: R30.1 41.45,57.55 v42.95,56.05 | 34.65,32.75 v34.45,32.55 34.7,32.8 U$2.20
  Bottom 0.254: v42.95,56.05 43,56.05 43.1,55.95 44.75,55.95 | v34.45,32.55 34.45,32.95 35.45,33.95 35.45,35.05 37.45,37.05 44.15,37.05 49.4,42.3 49.4,54.7 48.15,55.95 44.75,55.95 | 44.6,55.95 44.75,55.95
N$2
  Top 0.254: U$1.36 30.02,46.02 25.25,41.25 25.25,38.59 R45.2
N$3
  Top 0.254: U$1.37 30.52,45.52 R3.2
N$4
  Top 0.254: 29.9,43.5 R4.2 30.1,43.79 30.1,44.4 31.02,45.32 U$1.38
N$5
  Top 0.254: R34.2 36.45,42.75 34.02,45.18 U$1.44
N$6
  Top 0.254: U$1.46 35.02,46.08 35.95,45.15 35.95,44.98 R7.2
N$7
  Top 0.254: U$1.47 35.52,46.38 36.35,45.55 36.78,45.55 R8.2
N$8
  Top 0.254: R35.2 37.45,42.55 34.52,45.48 U$1.45
N$9
  Top 0.254: U$1.34 29.02,46.52 28.45,45.95 27.46,45.95 R9.2
N$10
  Top 0.254: U$1.6 33.52,58.08 R10.2
N$11
  Top 0.64: L2.2 C20.2
N$12
  Top 0.178: U$1.54 38.05,50.45 38.85,51.25 41.25,51.25 45.71,55.71 47.69,55.71 49.7,53.7 49.7,51.8 50.25,51.25 R11.1
N$13
  Top 0.178: U$1.55 37.95,50.95 38.65,51.65 41.15,51.65 45.54,56.04 47.83,56.04 50.03,53.84 50.03,53.52 R12.1
N$14
  Top 0.178: U$1.56 37.85,51.45 38.45,52.05 41.05,52.05 45.4,56.4 48.15,56.4 49.7,54.85 R13.1
N$15
  Top 0.178: U$1.57 37.75,51.95 38.25,52.45 40.85,52.45 45.13,56.73 50.42,56.73 R14.1
N$16
  Top 0.178: U$1.58 37.7,52.45 38.1,52.85 40.6,52.85 44.85,57.1 49.16,57.1 R15.1
N$17
  Top 0.64: M14.1 M15.1 30.93,16.7 C2.1
N$18
  Top 0.178: R12.2 D3.+
N$19
  Top 0.178: R14.2 D1.+
N$20
  Top 0.178: R15.2 D0.+
N$21
  Top 0.178: R13.2 52.58,54.85 D2.+
N$22
  Top 0.254: U$1.39 31.52,44.72 R16.1
N$23
  Top 0.3: U$6.4 39.37,8.78 arc-90 C38.2
N$24
  Top 0.64: U13.P$2 39.7,23.76 C64.1
N$25
  pour Top (no thermals): 12.5,55 7.5,55 7.5,57 10.7,57 11,56.7 11,56.1 11.75,55.3 12.5,55.3
N$26  (via drill 0.3)
  Top 0.254: 12.27,53.63 v12.3,53.6 12.25,53.6 U1.4 | 13.1,49.84 C36.2 R1.1 v14.2,50.9 R5.2
  Bottom 0.254: v12.3,53.6 12.4,52.6 v14.2,50.9
N$27
  Top 0.406: L6.1 14.38,5.66 R2.1 16.21,5.66 C21.1
N$28
  Bottom 0.254: JP1.3 6.49,35.59 5.9,35 3.54,35 X1.24
N$29
  Top 0.254: C19.1 41.53,34.67 41.15,34.3 U$2.8
N$30
  Top 0.178: U$1.53 37.75,49.95 arc37 38.65,50.25 arc-44 R21.2
N$31
  Top 0.178: R21.1 40.29,50.38 41.97,50.38 41.9,50.35 OSC1.3
N$32
  Top 0.6: R22.2 44.26,46.21 OSC1.1
N$33
  Top 0.254: R23.2 R22.1
  Top 0.6: OSC1.4 41.89,45.81 42.24,45.46 42.24,44.3 | C10.1 42.24,44.3 | R23.2 42.26,44.31 42.24,44.3
N$34
  Top 0.406: GPS.14 R2.2
N$35
  Top 0.254: U$2.1 41.3,30.8 41.55,30.55 42.25,29.75 42.45,29.55 C11.1
N$36
  Top 0.254: R25.2 32.63,36.44 C18.1 33.49,37.45 OSC2.P$4
N$37  (via drill 0.3)
  Top 0.254: C19.2 42.56,38.94 v41.75,39.75 | 30.84,38.16 OSC2.P$3 arc-90 30.52,37.59 C34.2 v29.16,38.44 v29.15,38.45
  Bottom 0.254: v41.75,39.75 36.35,39.75 35.1,41 30.2,41 29.2,40 29.2,38.6 v29.15,38.45
N$38
  Top 0.254: U$2.25 36.7,29.9 36.3,29.5 35.45,29.5
  Top 0.305: C15.1 35.42,29.47 35.45,29.5
N$39
  Top 0.254: U$2.3 42.74,31.8 C16.1
N$40
  Top 0.254: U$2.5 41.45,32.8 41.7,33.05 42.76,33.05 C17.1
N$41
  Top 0.254: L6.2 13.27,4.93 12.6,5.6
  Top 0.406: GPS.11 11.8,7.2 arc53 12.6,5.6 arc-43 X4.P
N$42
  Top 0.6: U$9.P$2 32.4,8.6 33,8.75 C39.1
N$43
  Top 0.254: U$1.2 35.52,56.92 36.3,57.7 36.3,60.4 34.6,62.1 24.1,62.1 17.65,55.65 17.65,46.1 17.37,45.83 12.13,45.83 7.5,41.2 R17.2
N$44
  Top 0.64: C20.1 C22.1 U$4.P$5
N$45
  Top 0.254: U$1.43 33.52,44.58 R18.2
N$46
  Top 0.64: U$4.P$2 C2.2
N$47
  Top 0.254: GPS.9 SJ1.1
N$48
  Top 0.254: U$1.3 35.02,57.22 35.6,57.8 R24.2
N$49
  Top 0.254: U$3.27 25.4,28.7 arc81 26.6,27.3 L1.2 31.59,26.41 31.6,26.4 36.6,27.29 arc76 37.7,28.7 U$2.27 | 31.55,25.62 L2.1
  Top 0.64: L2.1 L1.2
N$50
  Top 0.254: U$1.4 34.52,57.42 34.8,57.7 34.8,60.5 34.2,61.1 24.25,61.1 18.49,55.34 18.49,47.79 18.46,47.76 18.46,45.64 17.83,45.01 12.71,45.01 8.9,41.2 R26.2
N$51  (via drill 0.3)
  Top 0.254: R27.1 9.9,38.6 v10.1,38.4
  Bottom 0.254: v10.1,38.4 10.1,36.8 9.7,36.4 JP1.2
N$52
  Top 0.305: U3.14 12.11,24.95 C25.1
N$53
  Top 0.305: U$2.30 39.2,28.9 arc35 39.55,27.8 arc36 39.95,27.5 arc-56 U13.P$4
N$54
  Top 0.305: U$2.29 U13.P$6
N$55
  Top 0.305: U6.3 L7.2
N$56
  Top 0.254: U$2.15 37.2,36.62 36.5,37.32 36.5,37.5 R34.1
N$57
  Top 0.254: U$2.14 37.7,37.31 R35.1
N$58
  Top 0.254: U$3.1 28.9,30.8 29.85,29.85 30.5,29.85 C27.1
N$59
  Top 0.254: U$3.25 24.4,29.67 C31.1
N$60
  Top 0.254: U$3.3 30.37,31.8 C32.1
N$61
  Top 0.254: 30.4,33.05 30.51,33.04 C33.1 30.5,33.3 29.65,33.3 29.15,32.8 U$3.5
N$62
  Top 0.254: C34.1 29.16,34.91 arc-90 U$3.8
N$63
  Top 0.64: L7.1 C48.1
N$64
  Top 0.64: U$8.P$2 42.12,23.11 C64.2
N$65
  Top 0.254: R29.1 52.24,11.64 C52.1 52.24,13.21 51.9,13.55 50.77,13.55 U6.13
N$66
  Top 0.254: 50.15,12.7 C53.1 | 50.15,12.7 R36.1 | U6.12 49.42,14.03 50.05,13.4 50.05,12.75 50.15,12.7
N$67
  Top 0.254: U6.14 50.05,15.25 50.25,15.05 L8.2
N$68
  Top 0.64: C55.1 C54.1 arc-90 54.01,15.26 R28.1 | C55.1 52.8,15.24 | C55.1 52.14,15.24 L8.1
N$69
  Top 0.508: 47.6,12.36 arc-90 L10.2
  Top 0.64: L9.1 L10.2 47.59,14.1 47.6,14
  pour Top (no thermals): 47.35,14.35 47.85,14.35 47.85,13.65 47.35,13.65
N$70
  Top 0.508: 46.2,8.8 C60.1
  Top 0.64: 46.2,8.8 arc28 C59.1 arc56 L9.2
N$71
  Top 0.152: U$6.8 42.66,8.78 42.67,8.79
  Top 0.64: 42.67,8.79 C61.2 C60.2
N$72
  Top 0.64: C48.2 C49.1 47.85,22.54 arc90 R37.1
N$73
  Top 0.254: U6.6 C62.1 arc-90 C62.1
  Top 0.64: C62.1 44.6,15.76 | 44.6,15.76 C63.1 | 44.6,15.76 R46.1
N$74
  Top 0.2: U$7.P$5 C38.1
N$75
  Top 0.2: U$7.P$2 C66.2
N$76
  Top 0.305: R38.1 45.8,23.1
  Top 0.64: R37.2 45.8,23.1 U$8.P$5
N$77
  Top 0.254: C26.1 R47.1 38.1,11.8 36.9,10.6 U$7.P$7
N$78
  Top 0.254: U$3.15 24.9,36.2 24.05,37.05 24.05,37.53 R44.1
N$79
  Top 0.254: R45.1 25.11,36.79 25.4,36.4 U$3.14
N$80
  Top 0.254: U$1.61 37.85,53.95 38.45,54.55 R33.2
N$81
  Top 0.254: U$1.62 37.65,54.45 38.65,55.45 39.1,55.45 R32.2
N$82
  Top 0.254: U$1.63 37.45,54.95 38.25,55.75 38.25,56.15 38.65,56.55 R31.2
N$83
  Top 0.254: U$1.64 37.15,55.45 37.65,55.95 37.65,56.55 38.65,57.55 R30.2
N$84
  Top 0.254: U$1.22 23.6,52.95 23.85,53 23.54,53 R43.2
N$85
  Top 0.254: U$1.21 24.3,53.45 23.55,54.1 23.54,54.2 R42.2
N$86
  Top 0.254: U$1.20 24.75,53.95 23.55,55.15 R41.2
N$87
  Top 0.254: U$1.19 25.3,54.45 R40.2
N$88  (via drill 0.3)
  Top 0.254: U$2.9 40.2,36 v40.15,36.15 | U$3.9 27.9,35.8 v28.25,36.15 28.15,36.25 v28.15,39.45 | v24.05,43.5 22.95,43.5 22.55,43.95 22.55,50.75 23.25,51.45 U$1.25
  Bottom 0.254: v40.15,36.15 37.25,36.15 35.95,34.85 35.95,33.65 35.05,32.75 35.05,32.25 34.75,31.95 33.85,31.95 33.05,32.75 33.05,34.25 32.75,34.55 29.95,34.55 v28.25,36.15 | v28.15,39.45 v24.05,43.5
N$89  (via drill 0.3)
  Top 0.254: U$2.11 39.2,41.75 39.35,41.9 v39.35,41.85 | v31.55,42.85 31.55,43.59 R16.2
  Bottom 0.254: v39.35,41.85 32.45,41.85 v31.55,42.85
N$90
  Top 0.254: U$1.35 29.52,46.22 24.01,40.71 R44.2
N$91
  Top 0.254: U$2.13 38.2,42.73 R7.1
N$92
  Top 0.254: U$3.13 25.9,40.9 R3.1
N$93
  Top 0.254: U$3.12 26.4,40.09 R4.1
N$94
  Top 0.254: U$2.12 38.7,43.63 R8.1
N$95
  Bottom 0.254: JP1.1 6.09,37.21 5.7,37.6 3.48,37.6 X1.26
N$96
  Top 0.64: C66.1 arc90 C66.1 D5.2 X7.P
  Top 1.016: 36.4,4.29 X7.P
N$97
  Top 0.2: U$7.P$11 C39.2
N$98
  Top 0.64: M1.2 U$9.P$5
N$99
  Top 0.64: M3.1 27.1,8.6 | 27.1,8.6 M1.1 | M2.1 27.1,8.6
N$100  (via drill 0.3)
  Top 0.254: R31.1 41.5,56.55 42.2,55.85 v42.15,55.85 | 33.95,33.25 v33.75,33.05 34,33.3 U$2.19
  Bottom 0.254: v42.15,55.85 42.4,55.55 42.5,55.45 47.85,55.45 48.96,54.34 48.96,42.44 44.08,37.55 37.25,37.55 34.95,35.25 34.95,34.25 v33.75,33.05
N$101  (via drill 0.3)
  Top 0.254: R32.1 41.15,55.55 v41.35,55.75 | 33.85,33.85 v33.75,33.95 33.9,33.8 U$2.18
  Bottom 0.254: v41.35,55.75 42.15,54.95 47.45,54.95 48.56,53.84 48.56,42.61 44,38.05 37.05,38.05 34.45,35.45 34.45,34.85 33.75,34.15 v33.75,33.95
N$102  (via drill 0.3)
  Top 0.254: R33.1 40.65,54.55 v41.05,54.95 | v33.85,35.15 33.85,34.85 34.4,34.3 U$2.17
  Bottom 0.254: v41.05,54.95 41.65,54.35 47.48,54.35 47.71,54.11 | v33.85,35.15 33.85,35.55 37.05,38.65 44.03,38.65 48.15,42.77 48.15,53.67 47.71,54.11 | 47.71,54.11 47.61,54.21
N$103
  Top 0.254: R40.1 22.4,56.15 20.4,54.15 20.4,34.45 22.05,32.8 U$3.20
N$104
  Top 0.254: R41.1 22.55,55.15 20.9,53.55 20.9,34.75 22.35,33.3 U$3.19
N$105
  Top 0.254: R42.1 22.45,54.1 21.45,53.2 21.45,34.95 22.6,33.8 U$3.18
N$106
  Top 0.254: R43.1 22.65,53.3 22,52.6 22,35.25 22.85,34.3 U$3.17
N$107
  Top 0.64: M6.2 M16.2 28.95,12.51 M7.1
N$108
  Top 0.305: U$10.P$7 25.05,14.5
  Top 0.64: 25.05,15.9 M12.1 | 25.05,15.9 25.05,14.5 M11.2 | M10.1 25.04,15.9 25.05,15.9
N$109
  Top 0.64: 27.05,16.7 M14.2 | 27.05,16.7 M12.2 | M13.2 27.05,16.71 27.05,16.7
N$110
  Top 0.254: C37.1 R19.1 37.2,11.6 36.4,10.8 U$7.P$8
N$111
  Top 0.254: U$10.P$6 25.55,13.85 26.2,14.5 M17.2
N$112
  Top 0.305: U$10.P$2 M4.2
  Top 0.64: M4.2 25.05,9.21 M3.2
N$113
  Top 0.254: U$10.P$3 25.55,11.25 25.95,10.86 M4.1
  Top 0.64: M4.1 M5.2 M6.1
PA_A_CTRL  (via drill 0.35)
  Top 0.254: U$1.15 29.02,56.88 28.45,57.4 v28.05,57.4 | v42.35,16.65 v42.35,16.64 R46.2
  Bottom 0.254: v28.05,57.4 28,57.35 27.85,57.35 20.9,50.29 20.9,29.3 24.95,25.25 35.5,25.25 36.5,24.25 36.5,17.75 37.6,16.65 v42.35,16.65
PA_G8  (via drill 0.35)
  Top 0.254: U$1.18 25.6,54.95 24.75,55.75 24.75,56.4 v24.7,56.45 | v50.9,10.75 v50.9,10.76 R36.2
  Bottom 0.254: v24.7,56.45 19.9,51.4 19.9,28.9 24.41,24.39 35.08,24.39 35.69,23.79 35.69,17.41 37.26,15.84 40.04,15.84 41.24,14.63 41.24,12.08 42.38,10.94 50.71,10.94 v50.9,10.75
PA_G16  (via drill 0.35)
  Top 0.254: U$1.17 26.6,55.45 v25.6,56.45 | v52.95,10.75 R29.2
  Bottom 0.254: v25.6,56.45 20.4,51.2 20.35,30.7 20.35,29.1 24.65,24.8 35.25,24.8 36.09,23.96 36.09,17.58 37.43,16.24 40.21,16.24 41.65,14.8 41.65,12.25 42.55,11.35 50.64,11.35 50.65,11.36 52.34,11.36 v52.95,10.75
PPS  (via drill 0.3)
  Top 0.254: U$1.9 32.02,57.58 31.75,57.85 31.75,59.7 31.5,59.95 27.95,59.95 | R20.2 27.63,59.63 27.95,59.95 | v6,17.6 6.2,17.8 6.2,32.1 11,36.9 v11,37.15 v11,41.2 14,44.2 18.2,44.2 19.3,45.3 19.3,55 24.25,59.95 27.95,59.95 | v10.5,15.2 10.6,15.1 15.9,15.1 16.2,15.4 GPS.4
  Bottom 0.254: v11,41.2 7.8,41.2 4.9,43.9 4.8,43.9 X1.29 | v6,17.6 6,17.5 7.5,16 9.7,16 v10.5,15.2
RADIO_A_EN  (via drill 0.35)
  Top 0.254: v29.46,57.97 30.02,57.41 U$1.13 | R19.2 37.2,14.26 v37,14.47
  Bottom 0.254: v29.46,57.97 29.41,57.97 28.74,58.64 27.74,58.64 26.7,57.6 24.1,57.6 18.9,51.8 18.9,28.75 24.07,23.58 34.74,23.58 34.87,23.45 34.87,17.08 36.99,14.96 36.99,14.76 v37,14.47
RST
  Top 0.254: U$1.1 36.02,56.72 36.9,57.6 36.9,59.2 | 36.9,59.2 36.9,60.5 34.89,62.51 23.93,62.51 17.24,55.81 17.24,46.3 17.17,46.23 11.73,46.23 6.7,41.2 6.7,38.1 6.2,37.6 3.8,37.6 3.5,37.3 3.5,35.04 X1.22 | R6.1 36.9,59.2
SCK
  Top 0.254: R17.1 7.5,37.3 6.5,36.3 X1.23
VBIAS
  Top 0.254: U6.16 50.1,16.25 50.3,16.45 50.94,16.45 arc90 C50.1
  Top 0.64: C50.1 C51.1 arc90 52.16,16.35 R39.1
VCC_PA1  (via drill 0.35)
  Top 0.406: R39.2 54,16.39 v54,17.2 | v42.9,12.3 v42.91,12.31 C58.2
  Top 0.64: R39.2 55.1,16.35 R28.2 L11.2 | L10.1 C56.2 arc-90 C56.2 C57.2 C58.2
  Bottom 0.6: v54,17.2 52.02,15.22 51.52,15.22 48.6,12.3 v42.9,12.3

### Text on the board
tPlace: TX_ON | FSK_PKT | BH_PKT | SENSOR_PKT | RX_NEMPTY | GPS | RF
bPlace: 1 | CS | 0
tNames: LoRa Board for Raspberry Pi V1.5 / design by Will Whang / 2018/03/28